# EAGLE design BPS6001 Classic Computing Shield (EAGLE 9.4.2)
DATABASE: E:\Dropbox\GadgetFactory\GadgetFactory_Engineering\Libraries\GadgetFactory-PARTSDB.txt

## Sheet 1 of 7
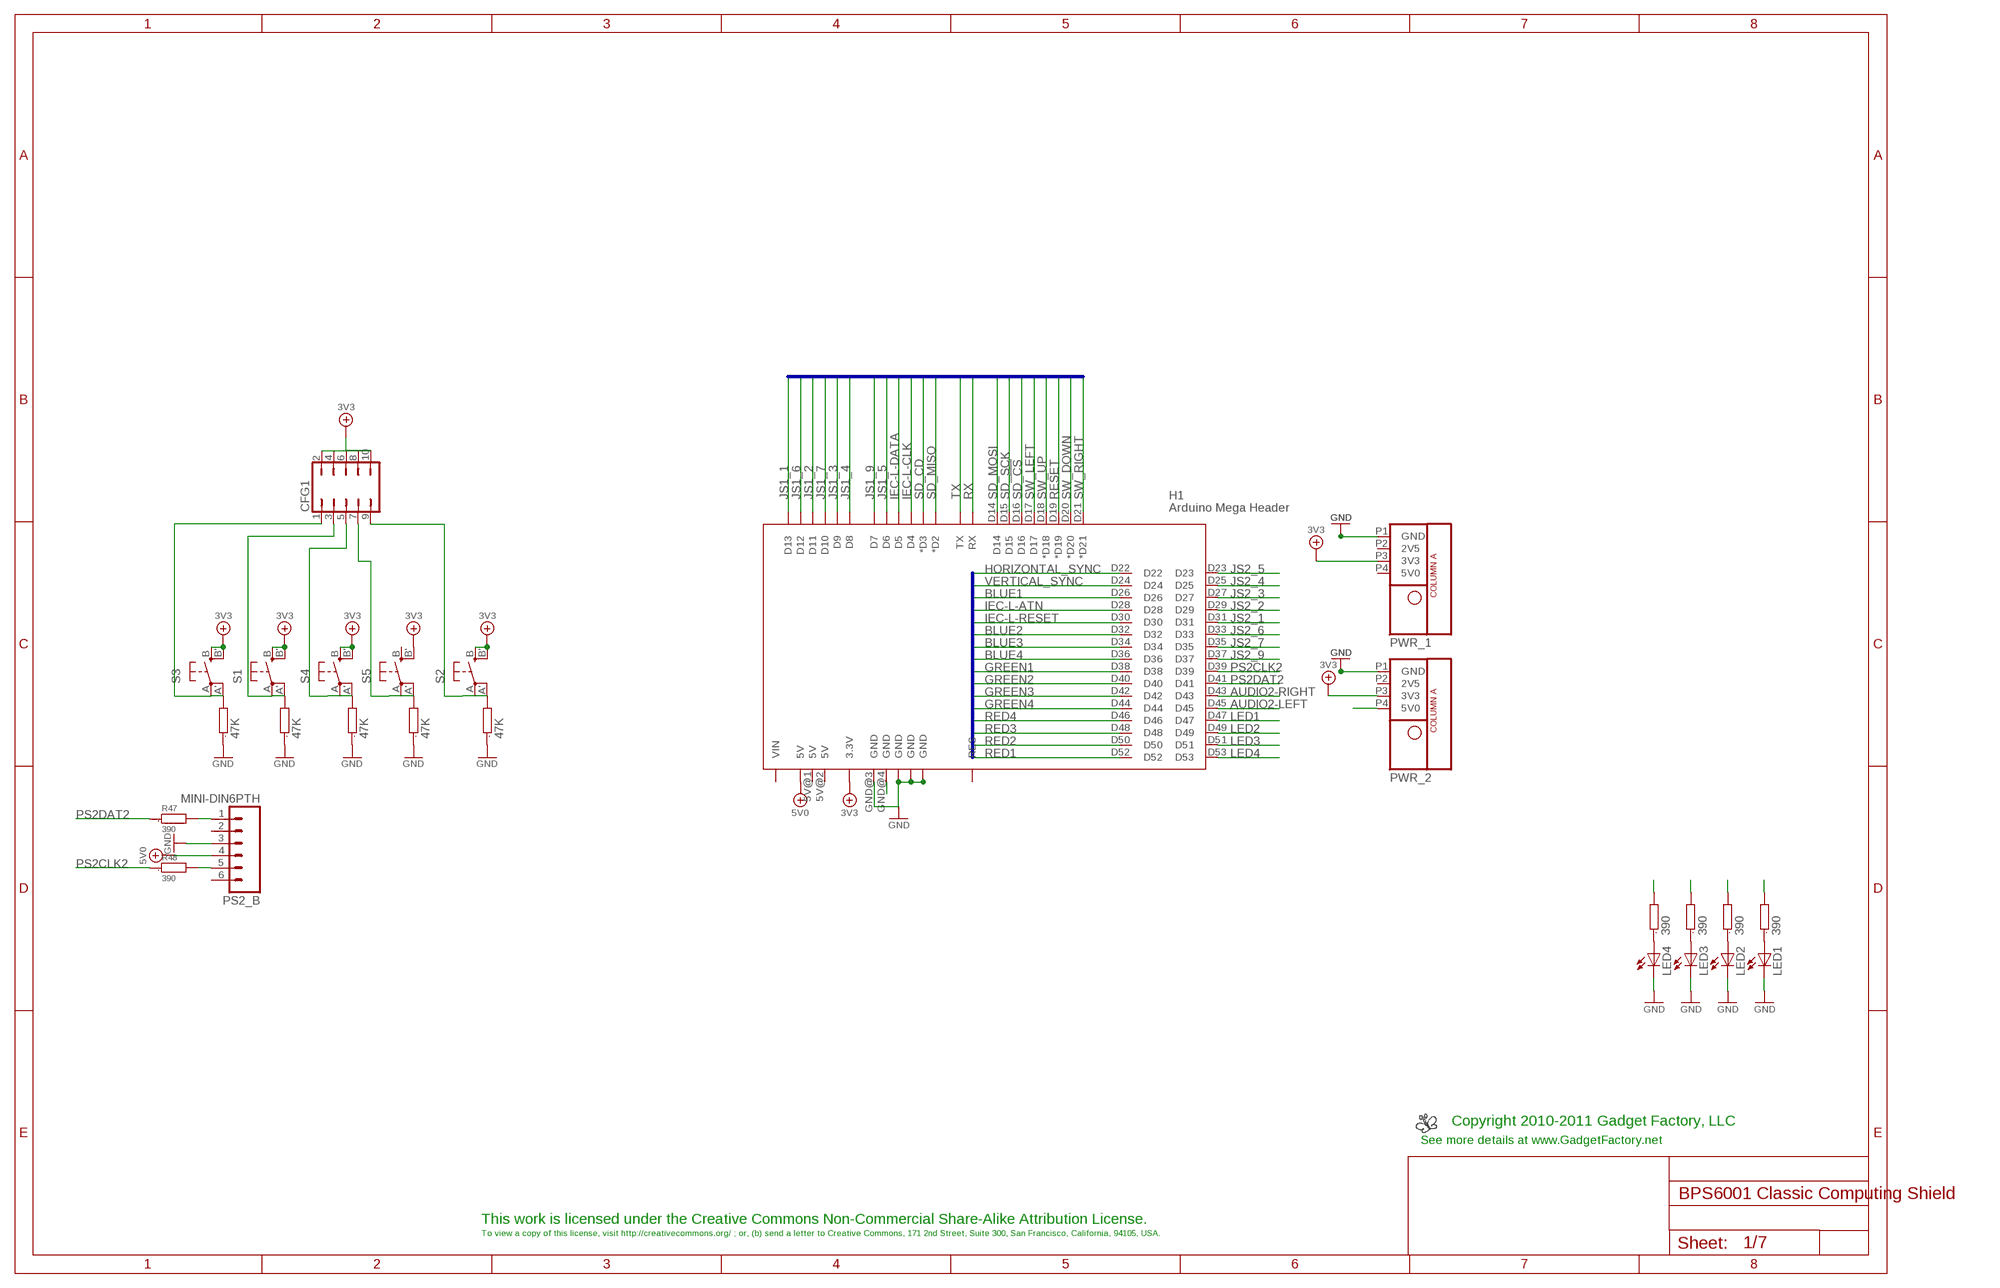
[diagram p0: schematic, sheet 1]

### Parts
CFG1  JP5Q  [JP5Q]
H1  Arduino Mega Header  AMEGA_SHIELD_NOANALOGNO_ANALOG  [AMEGA_SHIELD_NOANALOG]
LED1  LEDCHIPLED_0603  [CHIPLED_0603]
LED2  LEDCHIPLED_0603  [CHIPLED_0603]
LED3  LEDCHIPLED_0603  [CHIPLED_0603]
LED4  LEDCHIPLED_0603  [CHIPLED_0603]
LOGO1  BUTTERFLY_LOGO  [BUTTERFLY_LOGO]
PS2_B  MINI-DIN6PTH  [MINI-DIN6]
PWR_1  POWER_ONLYNOTEXT  [POWER_NO_TEXT]
PWR_2  POWER_ONLYNOTEXT  [POWER_NO_TEXT]
R9  47K  R0603  [0603]
R10  47K  R0603  [0603]
R11  47K  R0603  [0603]
R17  47K  R0603  [0603]
R18  47K  R0603  [0603]
R26  390  R0603  [0603]
R27  390  R0603  [0603]
R43  390  R0603  [0603]
R44  390  R0603  [0603]
R47  390  R0603  [0603]
R48  390  R0603  [0603]
S1  EVQQ2  [EVQ-Q2]
S2  EVQQ2  [EVQ-Q2]
S3  EVQQ2  [EVQ-Q2]
S4  EVQQ2  [EVQ-Q2]
S5  EVQQ2  [EVQ-Q2]

### Nets
3V3_PWR6: CFG1.2 CFG1.4 CFG1.6 CFG1.8 CFG1.10 H1.3.3V S1.B'(S1) S1.B(S) S2.B'(S1) S2.B(S) S3.B'(S1) S3.B(S) S4.B'(S1) S4.B(S) S5.B'(S1) ; supply symbol labelled 3V3 ; also sheet 2,3,5
3V3_PWR7: PWR_2.P3(3V3) ; supply symbol labelled 3V3
5V0: H1.5V@0(5V) ; also sheet 5
5V0_PS2: PS2_B.4 PWR_2.P4(5V0) ; supply symbol labelled 5V0
AUDIO2-LEFT: H1.D45 ; also sheet 4
AUDIO2-RIGHT: H1.D43 ; also sheet 4
BLUE1: H1.D26 ; also sheet 6
BLUE2: H1.D32 ; also sheet 6
BLUE3: H1.D34 ; also sheet 6
BLUE4: H1.D36 ; also sheet 6
GND: H1.GND@0(GND) H1.GND@1(GND) H1.GND@2(GND) H1.GND@3(GND) R9.1 R10.1 R11.1 R17.1 R18.1 ; also sheet 2,3,5,6
GREEN1: H1.D38 ; also sheet 6
GREEN2: H1.D40 ; also sheet 6
GREEN3: H1.D42 ; also sheet 6
GREEN4: H1.D44 ; also sheet 6
HORIZONTAL_SYNC: H1.D22 ; also sheet 6
IEC-L-ATN: H1.D28 ; also sheet 5
IEC-L-CLK: H1.D4 ; also sheet 5
IEC-L-DATA: H1.D5 ; also sheet 5
IEC-L-RESET: H1.D30 ; also sheet 5
JOY_3V3: PWR_1.P3(3V3) ; supply symbol labelled 3V3 ; also sheet 3
JOY_GND: H1.GND@4(GND) LED1.C LED2.C LED3.C LED4.C PS2_B.3 PWR_1.P1(GND) PWR_2.P1(GND) ; supply symbol labelled GND ; also sheet 3,4
JS1_1: H1.D13 ; also sheet 3
JS1_2: H1.D11 ; also sheet 3
JS1_3: H1.D9 ; also sheet 3
JS1_4: H1.D8 ; also sheet 3
JS1_5: H1.D6 ; also sheet 3
JS1_6: H1.D12 ; also sheet 3
JS1_7: H1.D10 ; also sheet 3
JS1_9: H1.D7 ; also sheet 3
JS2_1: H1.D31 ; also sheet 3
JS2_2: H1.D29 ; also sheet 3
JS2_3: H1.D27 ; also sheet 3
JS2_4: H1.D25 ; also sheet 3
JS2_5: H1.D23 ; also sheet 3
JS2_6: H1.D33 ; also sheet 3
JS2_7: H1.D35 ; also sheet 3
JS2_9: H1.D37 ; also sheet 3
LED1: H1.D47 R26.2
LED2: H1.D49 R27.2
LED3: H1.D51 R43.2
LED4: H1.D53 R44.2
N$3: LED4.A R44.1
N$9: LED3.A R43.1
N$10: LED2.A R27.1
N$11: LED1.A R26.1
N$16: PS2_B.1 R47.2
N$17: PS2_B.5 R48.2
PS2CLK2: H1.D39 R48.1
PS2DAT2: H1.D41 R47.1
RED1: H1.D52 ; also sheet 6
RED2: H1.D50 ; also sheet 6
RED3: H1.D48 ; also sheet 6
RED4: H1.D46 ; also sheet 6
RESET: CFG1.9 H1.D19(*D19) R11.2 S2.A'(P1) S2.A(P)
RX: H1.RX
SD_!CS: H1.D16 ; also sheet 2
SD_CD: H1.D3(*D3) ; also sheet 2
SD_MISO: H1.D2(*D2) ; also sheet 2
SD_MOSI: H1.D14 ; also sheet 2
SD_SCK: H1.D15 ; also sheet 2
SW_DOWN: CFG1.5 H1.D20(*D20) R17.2 S4.A'(P1) S4.A(P)
SW_LEFT: CFG1.1 H1.D17 R9.2 S3.A'(P1) S3.A(P)
SW_RIGHT: CFG1.7 H1.D21(*D21) R18.2 S5.A'(P1) S5.A(P)
SW_UP: CFG1.3 H1.D18(*D18) R10.2 S1.A'(P1) S1.A(P)
TX: H1.TX
VERTICAL_SYNC: H1.D24 ; also sheet 6
Unconnected: H1.5V@1(5V) H1.5V@2(5V) H1.RES H1.VIN PS2_B.2 PS2_B.6 PWR_1.P2(2V5) PWR_1.P4(5V0) PWR_2.P2(2V5) S5.B(S)

### Buses
AUDIO-,AUDIO+,BLUE[1..4],GREEN[1..4],HORIZONTAL_SYNC,IEC-L-CLK,IEC-L-DATA,JS1_[1..9],JS2_[1..9],LED[1..4],PS2CLK2,PS2DAT2,RED[1..4],RESET,SW[1..4]

### Notes on the sheet
- Copyright 2010-2011 Gadget Factory, LLC
- See more details at www.GadgetFactory.net
- This work is licensed under the Creative Commons Non-Commercial Share-Alike Attribution License.
- To view a copy of this license, visit http://creativecommons.org/ ; or, (b) send a letter to Creative Commons, 171 2nd Street, Suite 300, San Francisco, California, 94105, USA.

## Sheet 2 of 7: SD Card
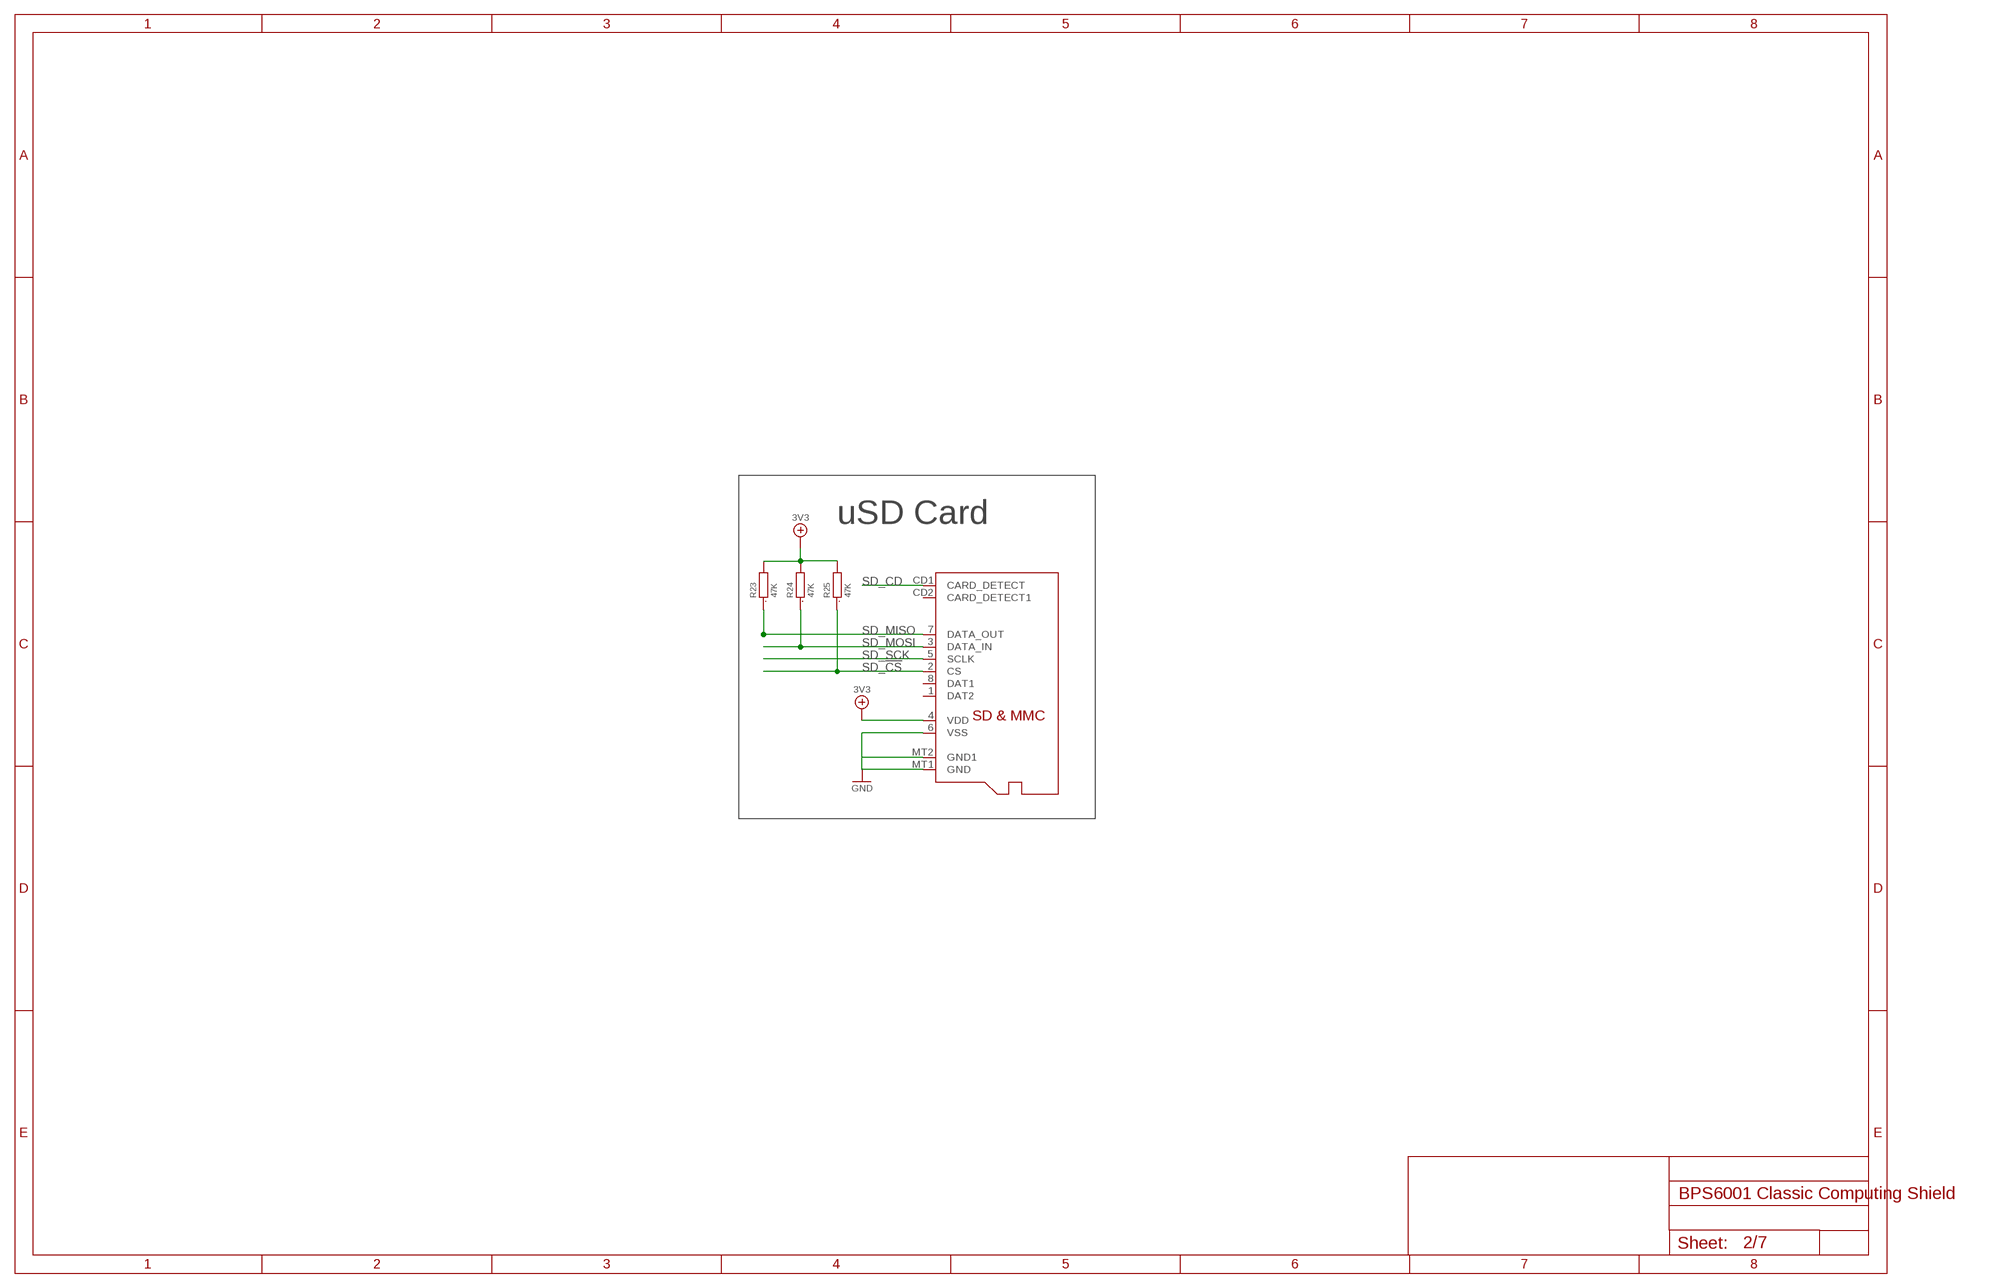
[diagram p1: schematic, sheet 2]

### Parts
R23  47K  R0603  [0603]
R24  47K  R0603  [0603]
R25  47K  R0603  [0603]
SD1  MICROSD  [MICROSD]

### Nets
3V3_PWR6: R23.2 R24.2 R25.2 SD1.4(VDD) ; supply symbol labelled 3V3 ; also sheet 1,3,5
GND: SD1.6(VSS) SD1.MT1(GND) SD1.MT2(GND1) ; also sheet 1,3,5,6
SD_!CS: R25.1 SD1.2(CS) ; also sheet 1
SD_CD: SD1.CD1(CARD_DETECT) ; also sheet 1
SD_MISO: R23.1 SD1.7(DATA_OUT) ; also sheet 1
SD_MOSI: R24.1 SD1.3(DATA_IN) ; also sheet 1
SD_SCK: SD1.5(SCLK) ; also sheet 1
Unconnected: SD1.1(DAT2) SD1.8(DAT1) SD1.CD2(CARD_DETECT1)

### Notes on the sheet
- uSD Card

## Sheet 3 of 7: Joysticks
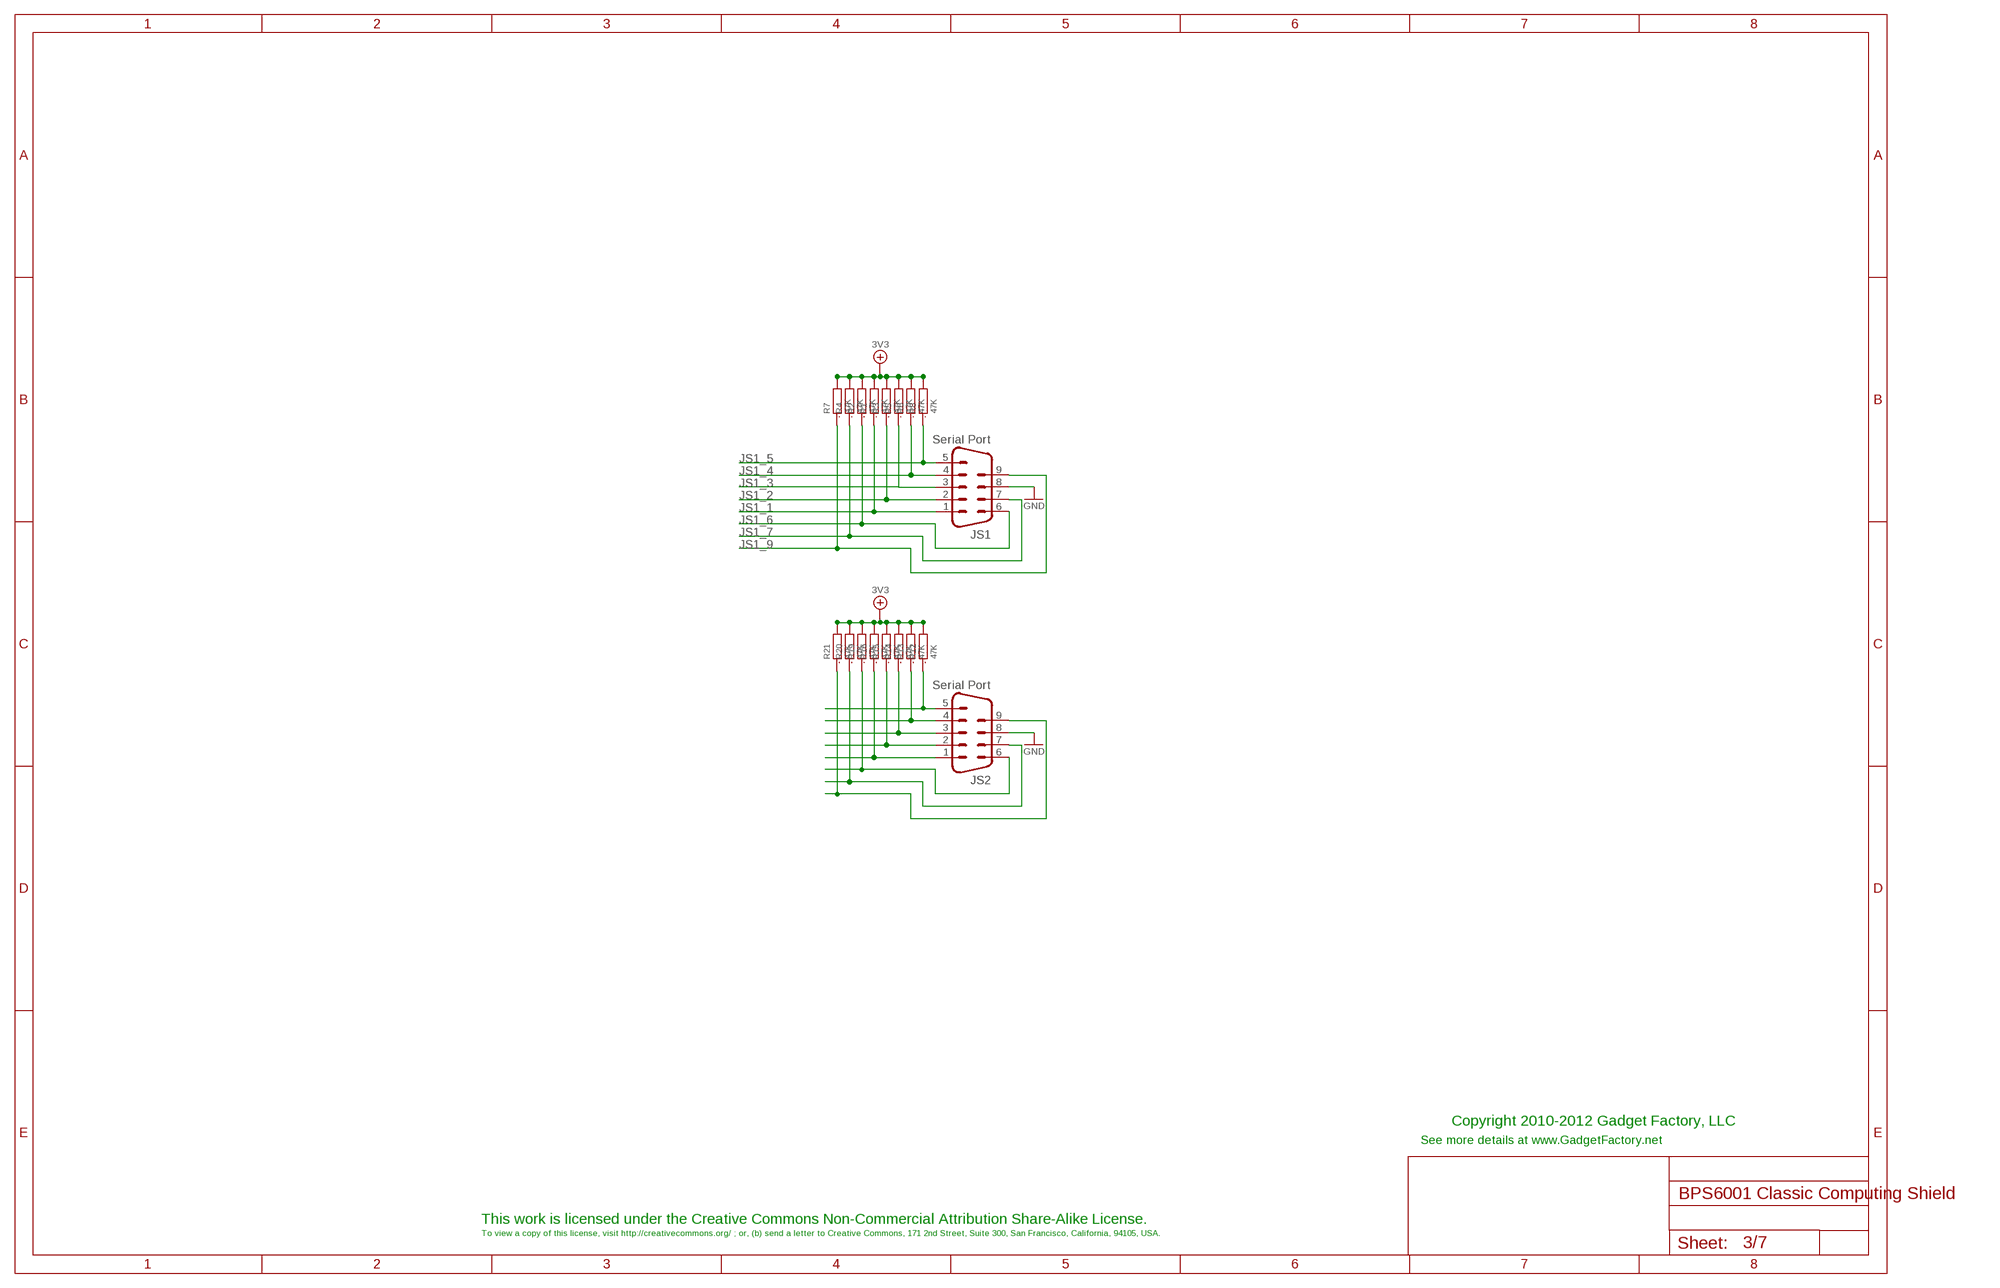
[diagram p2: schematic, sheet 3]

### Parts
JS1  Serial Port  M09HP  [M09HP]
JS2  Serial Port  M09HP  [M09HP]
R1  47K  R0603  [0603]
R2  47K  R0603  [0603]
R3  47K  R0603  [0603]
R4  47K  R0603  [0603]
R5  47K  R0603  [0603]
R6  47K  R0603  [0603]
R7  47K  R0603  [0603]
R8  47K  R0603  [0603]
R12  47K  R0603  [0603]
R13  47K  R0603  [0603]
R14  47K  R0603  [0603]
R15  47K  R0603  [0603]
R16  47K  R0603  [0603]
R19  47K  R0603  [0603]
R20  47K  R0603  [0603]
R21  47K  R0603  [0603]

### Nets
3V3_PWR6: R1.2 R2.2 R3.2 R4.2 R5.2 R6.2 R7.2 R8.2 ; also sheet 1,2,5
GND: JS1.8 ; also sheet 1,2,5,6
JOY_3V3: R12.2 R13.2 R14.2 R15.2 R16.2 R19.2 R20.2 R21.2 ; also sheet 1
JOY_GND: JS2.8 ; supply symbol labelled GND ; also sheet 1,4
JS1_1: JS1.1 R1.1 ; also sheet 1
JS1_2: JS1.2 R3.1 ; also sheet 1
JS1_3: JS1.3 R5.1 ; also sheet 1
JS1_4: JS1.4 R6.1 ; also sheet 1
JS1_5: JS1.5 R8.1 ; also sheet 1
JS1_6: JS1.6 R2.1 ; also sheet 1
JS1_7: JS1.7 R4.1 ; also sheet 1
JS1_9: JS1.9 R7.1 ; also sheet 1
JS2_1: JS2.1 R16.1 ; also sheet 1
JS2_2: JS2.2 R15.1 ; also sheet 1
JS2_3: JS2.3 R14.1 ; also sheet 1
JS2_4: JS2.4 R13.1 ; also sheet 1
JS2_5: JS2.5 R12.1 ; also sheet 1
JS2_6: JS2.6 R19.1 ; also sheet 1
JS2_7: JS2.7 R20.1 ; also sheet 1
JS2_9: JS2.9 R21.1 ; also sheet 1

### Notes on the sheet
- Copyright 2010-2012 Gadget Factory, LLC
- See more details at www.GadgetFactory.net
- This work is licensed under the Creative Commons Non-Commercial Attribution Share-Alike License.
- To view a copy of this license, visit http://creativecommons.org/ ; or, (b) send a letter to Creative Commons, 171 2nd Street, Suite 300, San Francisco, California, 94105, USA.

## Sheet 4 of 7: Audio
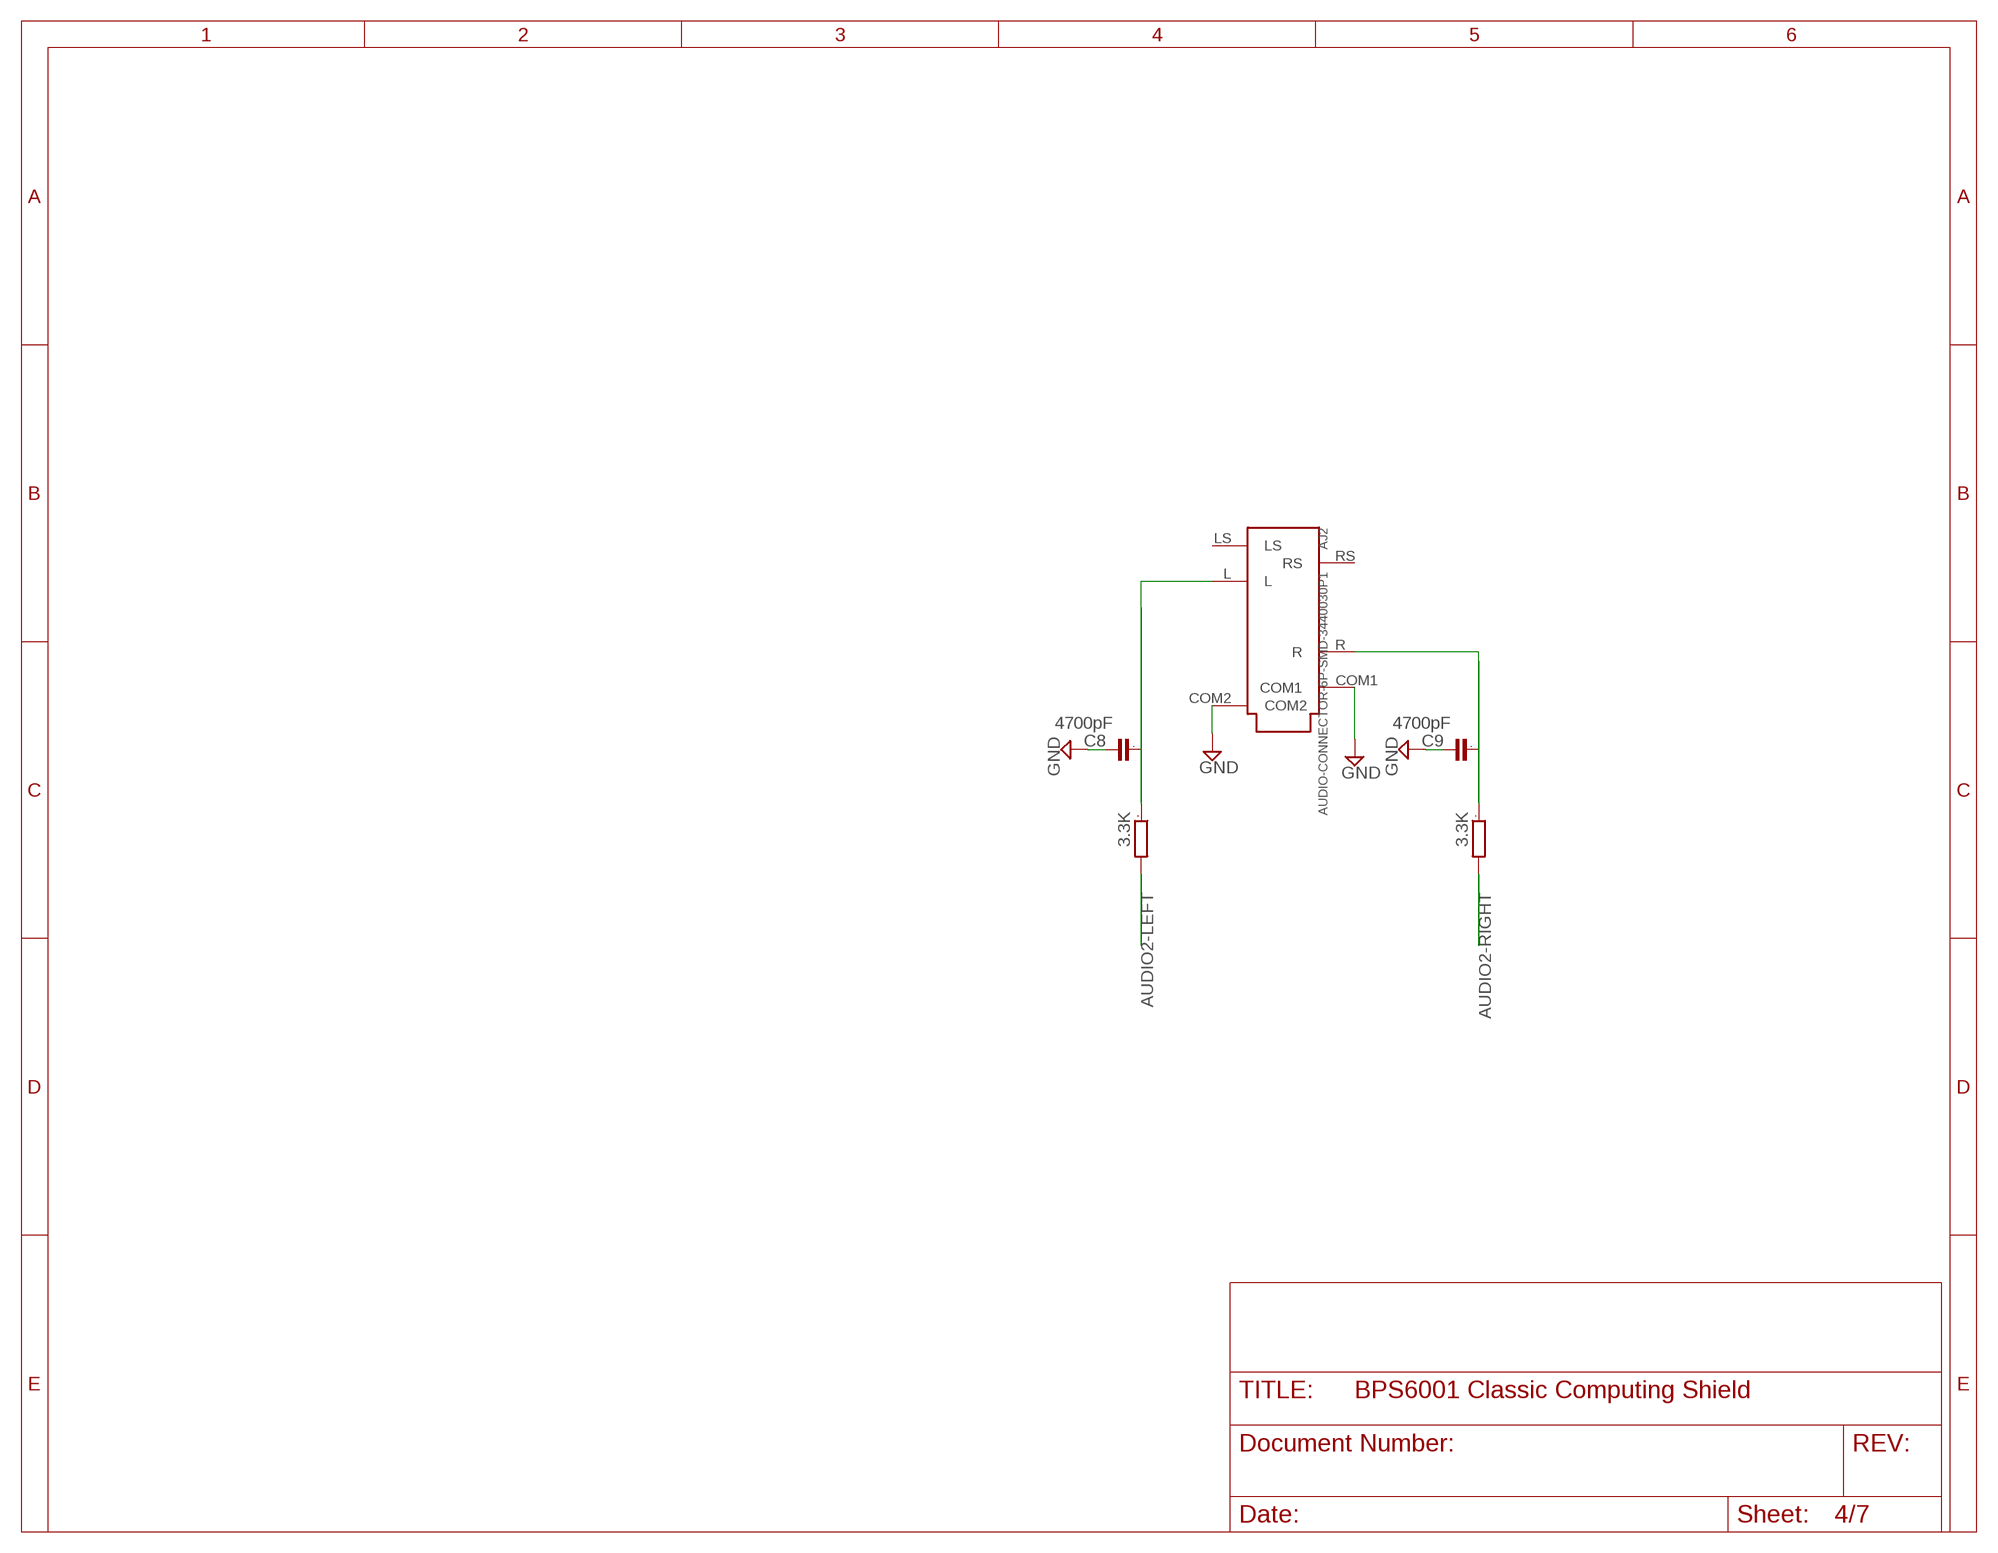
[diagram p3: schematic, sheet 4]

### Parts
AJ2  AUDIO-CONNECTOR-6P-SMD-3440030P1  [6P-SMD-3.5]
C8  4700pF  C0603  [0603]
C9  4700pF  C0603  [0603]
R45  3.3K  R0603  [0603]
R46  3.3K  R0603  [0603]

### Nets
AUDIO2-LEFT: R45.2 ; also sheet 1
AUDIO2-RIGHT: R46.2 ; also sheet 1
JOY_GND: AJ2.COM1 AJ2.COM2 C8.2 C9.2 ; supply symbol labelled GND ; also sheet 1,3
N$1: AJ2.L C8.1 R45.1
N$15: AJ2.R C9.1 R46.1
Unconnected: AJ2.LS AJ2.RS

## Sheet 5 of 7: RS232 IEC
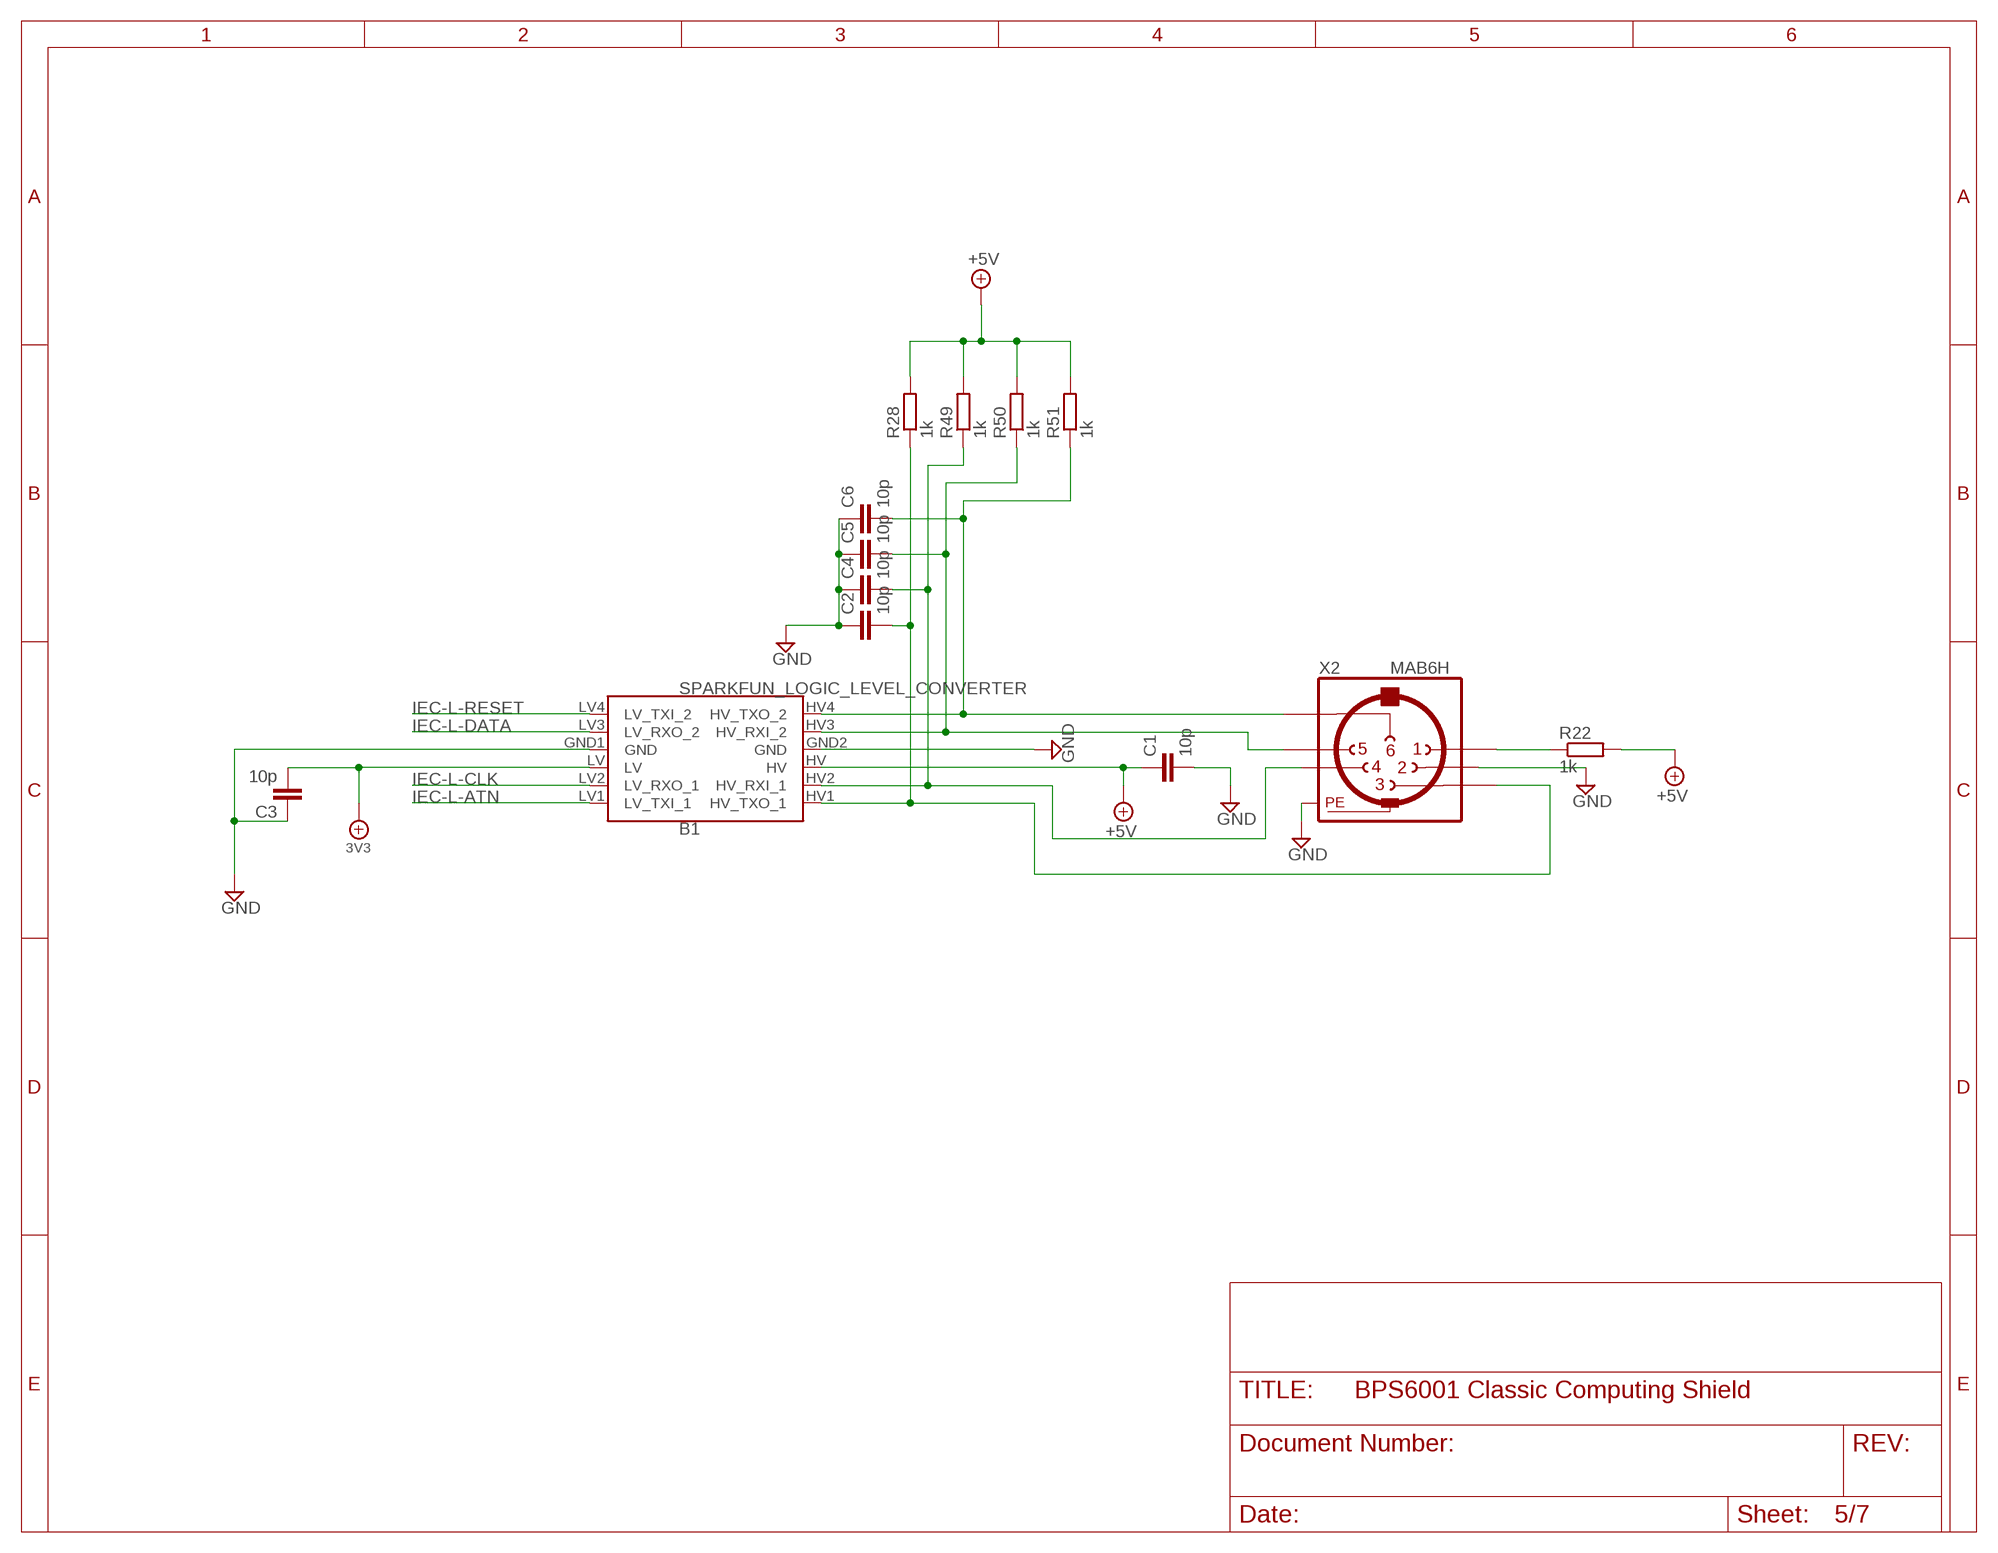
[diagram p4: schematic, sheet 5]

### Parts
B1  SPARKFUN_LOGIC_LEVEL_CONVERTER  [SPARKFUN_LOGIC_LEVEL_CONVERTER]
C1  10p  C-EUC0603  [C0603]
C2  10p  C-EUC0603  [C0603]
C3  10p  C-EUC0603  [C0603]
C4  10p  C-EUC0603  [C0603]
C5  10p  C-EUC0603  [C0603]
C6  10p  C-EUC0603  [C0603]
R22  1k  R-EU_R0603  [R0603]
R28  1k  R-EU_R0603  [R0603]
R49  1k  R-EU_R0603  [R0603]
R50  1k  R-EU_R0603  [R0603]
R51  1k  R-EU_R0603  [R0603]
X2  MAB6H  [MAB6H]

### Nets
3V3_PWR6: B1.LV C3.2 ; supply symbol labelled 3V3 ; also sheet 1,2,3
5V0: B1.HV C1.1 R22.2 R28.2 R49.2 R50.2 R51.2 ; supply symbol labelled +5V ; also sheet 1
GND: B1.GND1(GND) B1.GND2(GND) C1.2 C2.1 C3.1 C4.1 C5.1 C6.1 X2.2 X2.PE X2.PE@(PE) ; also sheet 1,2,3,6
IEC-H-ATN: B1.HV1(HV_TXO_1) C2.2 R28.1 X2.3
IEC-H-CLK: B1.HV2(HV_RXI_1) C4.2 R49.1 X2.4
IEC-H-DATA: B1.HV3(HV_RXI_2) C5.2 R50.1 X2.5
IEC-H-RESET: B1.HV4(HV_TXO_2) C6.2 R51.1 X2.6
IEC-H-SRQ: R22.1 X2.1
IEC-L-ATN: B1.LV1(LV_TXI_1) ; also sheet 1
IEC-L-CLK: B1.LV2(LV_RXO_1) ; also sheet 1
IEC-L-DATA: B1.LV3(LV_RXO_2) ; also sheet 1
IEC-L-RESET: B1.LV4(LV_TXI_2) ; also sheet 1

## Sheet 6 of 7: 4096 VGA
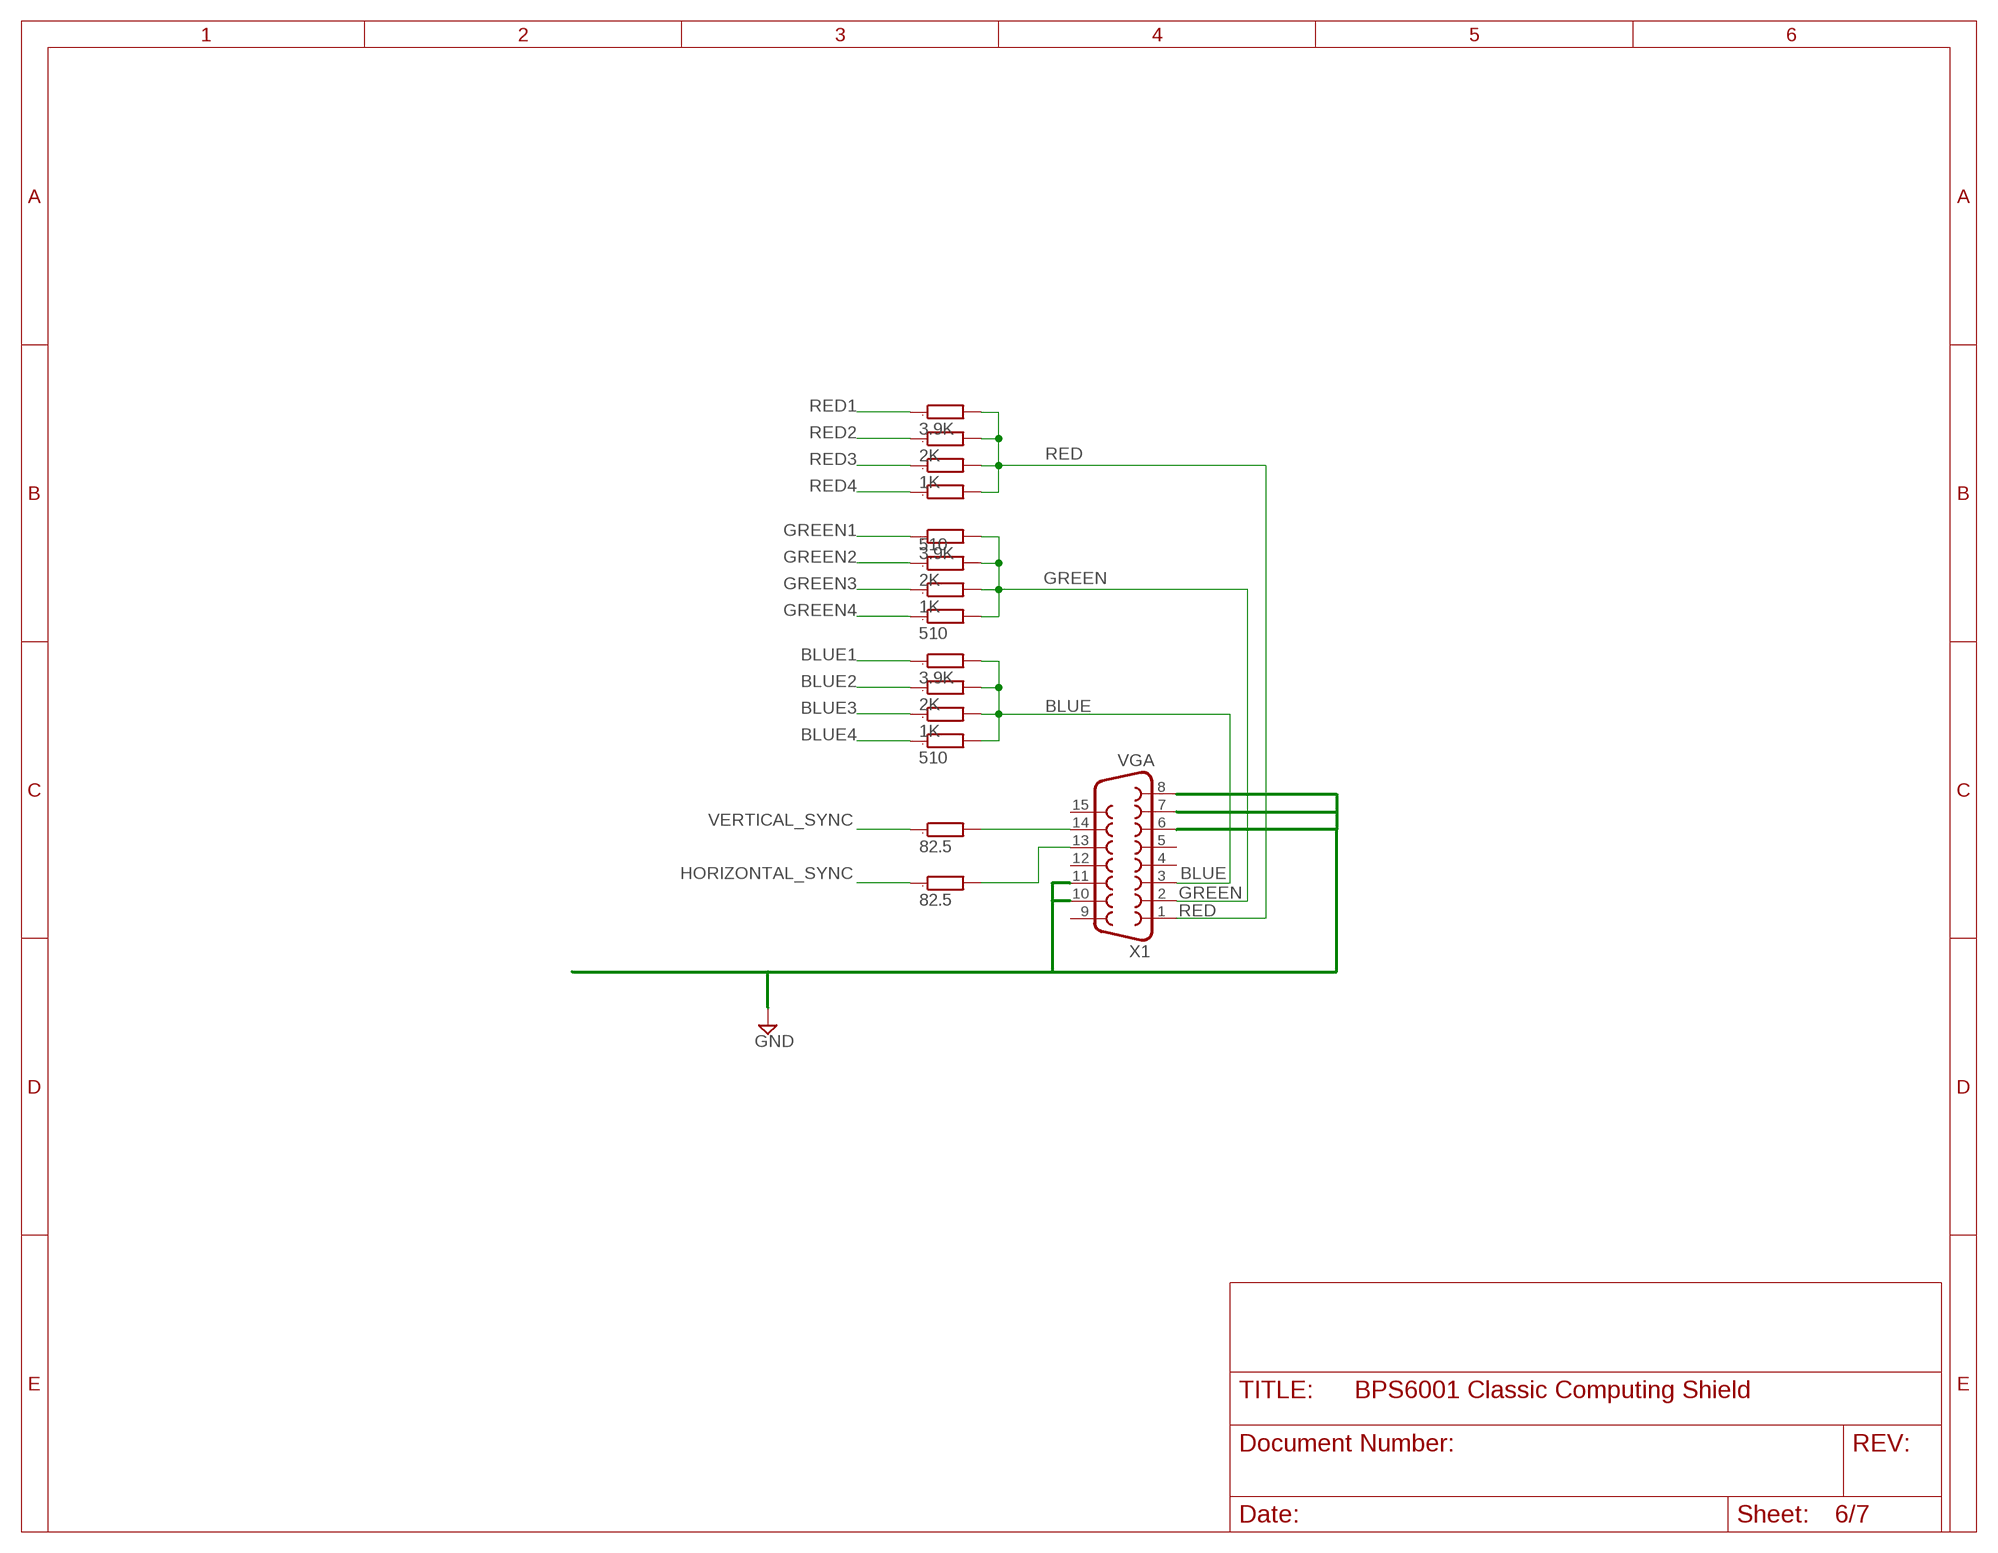
[diagram p5: schematic, sheet 6]

### Parts
R29  82.5  R0603  [0603]
R30  82.5  R0603  [0603]
R31  3.9K  R0603  [0603]
R32  2K  R0603  [0603]
R33  1K  R0603  [0603]
R34  510  R0603  [0603]
R35  3.9K  R0603  [0603]
R36  2K  R0603  [0603]
R37  1K  R0603  [0603]
R38  510  R0603  [0603]
R39  510  R0603  [0603]
R40  1K  R0603  [0603]
R41  2K  R0603  [0603]
R42  3.9K  R0603  [0603]
X1  VGA  F15HDH  [HDF15H]

### Nets
BLUE: R31.2 R32.2 R33.2 R34.2 X1.3
BLUE1: R31.1 ; also sheet 1
BLUE2: R32.1 ; also sheet 1
BLUE3: R33.1 ; also sheet 1
BLUE4: R34.1 ; also sheet 1
GND: X1.6 X1.7 X1.8 X1.10 X1.11 ; also sheet 1,2,3,5
GREEN: R35.2 R36.2 R37.2 R38.2 X1.2
GREEN1: R35.1 ; also sheet 1
GREEN2: R36.1 ; also sheet 1
GREEN3: R37.1 ; also sheet 1
GREEN4: R38.1 ; also sheet 1
HORIZONTAL_SYNC: R29.1 ; also sheet 1
N$4: R29.2 X1.13
N$5: R30.2 X1.14
RED: R39.2 R40.2 R41.2 R42.2 X1.1
RED1: R42.1 ; also sheet 1
RED2: R41.1 ; also sheet 1
RED3: R40.1 ; also sheet 1
RED4: R39.1 ; also sheet 1
VERTICAL_SYNC: R30.1 ; also sheet 1
Unconnected: X1.4 X1.5 X1.9 X1.12 X1.15

## Sheet 7 of 7

## Library data of the parts
AJ2 = OPL Eagle Library:AUDIO-CONNECTOR-6P-SMD: When you use the footprint ,place notice 46 (layer)milling ,there is some important information.; PARTNO: 3440030P1
B1 = SparkFun-Boards:SPARKFUN_LOGIC_LEVEL_CONVERTER: SparkFun Logic Level Converter -Bi-Directional This is the mechnical outline for the 3.3V - 5V bi directional logic level converter. *Note, the "LOCK" Package has the header pins staggered by an offset of 5 mils (off center line), so that when you slide a row of standard 0.1" headers into the PTH pads, it will hold position vertically. See the follwing turorial for more information on this type of special footprints: Sneaky Footprints <https://www.sparkfun.com/tutorials/114> SparkFun Products: SparkFun Logic Level Converter - Bi-Directional <https://www.sparkfun.com/products/12009>
C1-C6 = resistor:C-EU: CAPACITOR, European symbol
C8 C9 = GadgetFactory:C: CAPACITOR, European symbol; PARTNO: C0603C472J5RACTU
CFG1 = jumper:JP5Q: JUMPER; PARTNO: M20-9720545
H1 = Papilio:AMEGA_SHIELD_NOANALOG; PARTNO: Arduino_Mega_Header
JS1 JS2 = con-subd:M09: SUB-D; PARTNO: 10090097-P094VLF
LED1-LED4 = led:LED: LED OSRAM: - CHIPLED LG R971, LG N971, LY N971, LG Q971, LY Q971, LO R971, LY R971 LH N974, LH R974 LS Q976, LO Q976, LY Q976 LO Q996 - Hyper CHIPLED LW Q18S LB Q993, LB Q99A, LB R99A - SideLED LS A670, LO A670, LY A670, LG A670, LP A670 LB A673, LV A673, LT A673, LW A673 LH A674 LY A675 LS A676, LA A676, LO A676, LY A676, LW A676 LS A679, LY A679, LG A679 - Hyper Micro SIDELED® LS Y876, LA Y876, LO Y876, LY Y876 LT Y87S - SmartLED LW L88C, LW L88S LB L89C, LB L89S, LG L890 LS L89K, LO L89K, LY L89K LS L896, LA L896, LO L896, LY L896 - TOPLED LS T670, LO T670, LY T670, LG T670, LP T670 LSG T670, LSP T670, LSY T670, LOP T670, LYG T670 LG T671, LOG T671, LSG T671 LB T673, LV T673, LT T673, LW T673 LH T674 LS T676, LA T676, LO T676, LY T676, LB T676, LH T676, LSB T676, LW T676 LB T67C, LV T67C, LT T67C, LS T67K, LO T67K, LY T67K, LW E67C LS E67B, LA E67B, LO E67B, LY E67B, LB E67C, LV E67C, LT E67C LW T67C LS T679, LY T679, LG T679 LS T770, LO T770, LY T770, LG T770, LP T770 LB T773, LV T773, LT T773, LW T773 LH T774 LS E675, LA E675, LY E675, LS T675 LS T776, LA T776, LO T776, LY T776, LB T776 LHGB T686 LT T68C, LB T68C - Hyper Mini TOPLED® LB M676 - Mini TOPLED Santana® LG M470 LS M47K, LO M47K, LY M47K Source: http://www.osram.convergy.de LUXEON: - LUMILED® LXK2-PW12-R00, LXK2-PW12-S00, LXK2-PW14-U00, LXK2-PW14-V00 LXK2-PM12-R00, LXK2-PM12-S00, LXK2-PM14-U00 LXK2-PE12-Q00, LXK2-PE12-R00, LXK2-PE12-S00, LXK2-PE14-T00, LXK2-PE14-U00 LXK2-PB12-K00, LXK2-PB12-L00, LXK2-PB12-M00, LXK2-PB14-N00, LXK2-PB14-P00, LXK2-PB14-Q00 LXK2-PR12-L00, LXK2-PR12-M00, LXK2-PR14-Q00, LXK2-PR14-R00 LXK2-PD12-Q00, LXK2-PD12-R00, LXK2-PD12-S00 LXK2-PH12-R00, LXK2-PH12-S00 LXK2-PL12-P00, LXK2-PL12-Q00, LXK2-PL12-R00 Source: www.luxeon.com KINGBRIGHT: KA-3528ASYC Source: www.kingbright.com; PARTNO: LTST-C190GKT
LOGO1 = GadgetFactory_Pub:BUTTERFLY_LOGO; BOM: EXCLUDE
PS2_B = SparkFun-Connectors:MINI-DIN6: mini DIN 6 Connector Commonly found on the back of a computer for PS2 keyboard and mice. Schematic and footprint are proven. Spark Fun Electronics SKU : PRT-08509
PWR_1 PWR_2 = Papilio:POWER_ONLY; BOM: EXCLUDE
R1-R21 = GadgetFactory:R: RESISTOR, European symbol; PARTNO: RMCF0603JT47K0
R22 R28 R49-R51 = resistor:R-EU_: RESISTOR, European symbol
R23-R25 = GadgetFactory_6.0:R: RESISTOR, European symbol; PARTNO: RMCF0603JT47K0
R26 R27 R43 R44 = GadgetFactory:R: RESISTOR, European symbol; PARTNO: RMCF0603JT390R
R29 R30 = GadgetFactory:R: RESISTOR, European symbol; PARTNO: RMCF0603FT82R5
R31 R35 R42 = GadgetFactory:R: RESISTOR, European symbol; PARTNO: RMCF0603JT3K90
R32 R36 R41 = GadgetFactory:R: RESISTOR, European symbol; PARTNO: RMCF0603JT2K00
R33 R37 R40 = GadgetFactory:R: RESISTOR, European symbol; PARTNO: RMCF0603JT1K00
R34 R38 R39 = GadgetFactory:R: RESISTOR, European symbol; PARTNO: RMCF0603JT510R
R45 R46 = GadgetFactory:R: RESISTOR, European symbol; PARTNO: RMCF0603JT3K30
R47 R48 = GadgetFactory_6.0:R: RESISTOR, European symbol; PARTNO: RMCF0603JT390R
S1-S5 = adafruit:EVQQ2: SMT 6mm switch, EVQQ2 series http://www.ladyada.net/library/eagle; PARTNO: PTS525SM10SMTR LFS
SD1 = adafruit:MICROSD: Micro-SD / Transflash card holder with SPI pinout For the 3M # 2908-05WB-MG and/or 4UCON #19656 push-push type; PARTNO: 101-00660-68-6
X1 = GadgetFactory_6.0:F15: SUB-D; OC_FARNELL: unknown; OC_NEWARK: unknown; PARTNO: 1-1734530-1
X2 = con-hirschmann:MAB6H: Female CONNECTOR 6 pins with shield, horizontal (DIN 45322); MF: FARNELL; MPN: MAB 6 H; OC_FARNELL: 809901; OC_NEWARK: 67C7887

## Board
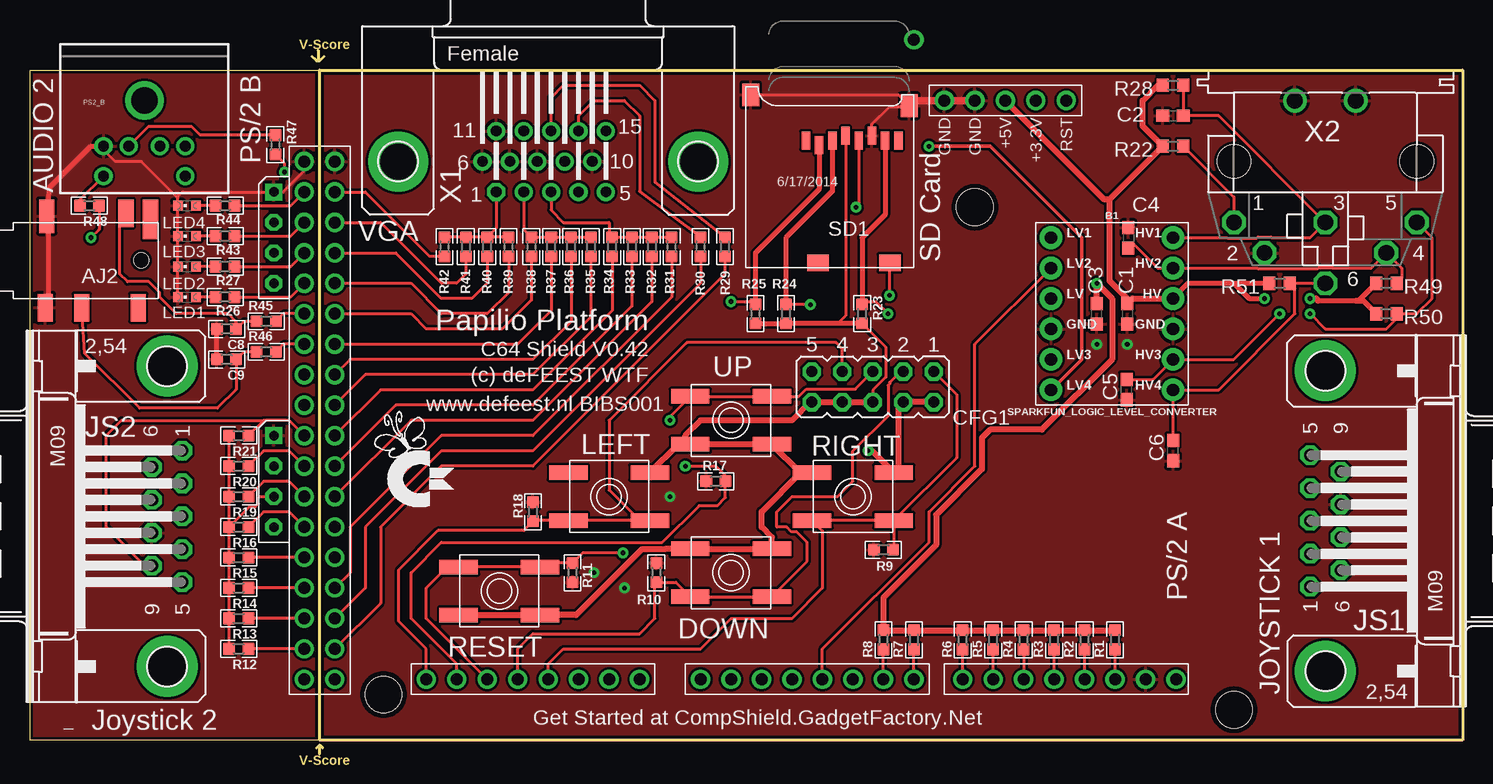
[diagram p6: board, top side]
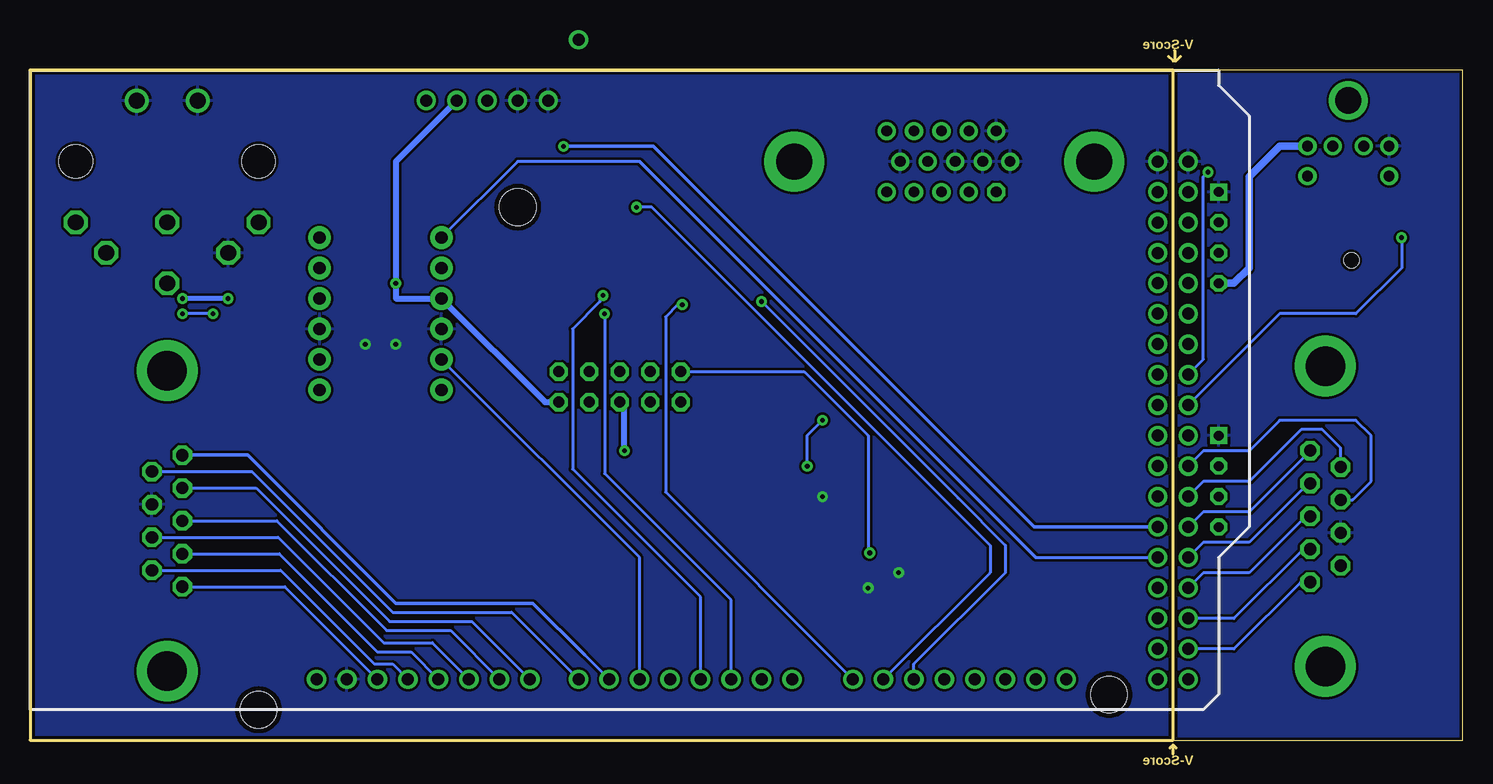
[diagram p7: board, bottom side, seen from below]

Size 119.38 x 58.67 mm. Coordinates in mm from the lower left corner, seen from the top.
Outline: 24.13,1.14 119.38,1.14 119.38,57.02 24.13,57.02
Outline: 24.13,1.14 24.13,57.02
Outline: 24.13,1.14 0,1.14 0,57.02 24.13,57.02
Outline: 24,58.67 24,57.79
Outline: 24,57.79 24.13,57.79 24.51,58.17
Outline: 24,57.79 23.88,57.79 23.5,58.17
Outline: 24.13,0 24.13,0.76
Outline: 24.13,0.76 23.88,0.51
Outline: 24.13,0.76 24.38,0.51
Copper layers (1*16): Top 0.035mm / dielectric 1.5mm / Bottom 0.035mm
Design rules "SparkFun_Derived_GoldePheonix_10mil": minimum track width 10mil, minimum drill 15mil, track to track 8mil, track to pad 8mil, pad to pad 8mil, via to via 8mil, smd to smd 8mil, copper to edge 10mil, drill to drill 8mil, minimum pad ring 12mil, minimum via ring 10mil, stop-mask expansion 4mil, vias tented up to drill 18mil, thermal gap 10mil

### Footprints (pad centres in the part's own frame; a part is rotated, then mirrored left to right if it is on the bottom)
6P-SMD-3.5 = smd 1.27 x 2.286: COM1 2.413,3.937; L -4.318,-3.937; R -0.635,3.937; RS -5.334,3.937 | smd 1.27 x 2.794: COM2 2.286,-3.683 | smd 1.27 x 3.302: LS -6.35,-3.429 | hole 1.27: -5.588,0
SPARKFUN_LOGIC_LEVEL_CONVERTER = drill 1.016 pad 1.88: GND1 -5.08,-1.27; GND2 5.08,-1.27; HV 5.08,1.27; HV1 5.08,6.35; HV2 5.08,3.81; HV3 5.08,-3.81; HV4 5.08,-6.35; LV -5.08,1.27; LV1 -5.08,6.35; LV2 -5.08,3.81; LV3 -5.08,-3.81; LV4 -5.08,-6.35
C0603 = smd 1.1 x 1: 1 -0.85,0; 2 0.85,0
0603 = smd 1 x 1: 1 -0.8,0; 2 0.8,0
JP5Q = drill 0.914 octagon: 1 -5.08,-1.27; 2 -5.08,1.27; 3 -2.54,-1.27; 4 -2.54,1.27; 5 0,-1.27; 6 0,1.27; 7 2.54,-1.27; 8 2.54,1.27; 9 5.08,-1.27; 10 5.08,1.27
AMEGA_SHIELD_NOANALOG = drill 1 pad 1.422: 3.3V 35.56,2.54; 5V@0 38.1,2.54; 5V@1 93.98,50.8; 5V@2 96.52,50.8; AREF 23.876,50.8; D2 58.42,50.8; D3 55.88,50.8; D4 53.34,50.8; D5 50.8,50.8; D6 48.26,50.8; D7 45.72,50.8; D8 41.656,50.8; D9 39.116,50.8; D10 36.576,50.8; D11 34.036,50.8; D12 31.496,50.8; D13 28.956,50.8; D14 68.58,50.8; D15 71.12,50.8; D16 73.66,50.8; D17 76.2,50.8; D18 78.74,50.8; D19 81.28,50.8; D20 83.82,50.8; D21 86.36,50.8; D22 93.98,48.26; D23 96.52,48.26; D24 93.98,45.72; D25 96.52,45.72; D26 93.98,43.18; D27 96.52,43.18; D28 93.98,40.64; D29 96.52,40.64; D30 93.98,38.1; D31 96.52,38.1; D32 93.98,35.56; D33 96.52,35.56; D34 93.98,33.02; D35 96.52,33.02; D36 93.98,30.48; D37 96.52,30.48; D38 93.98,27.94; D39 96.52,27.94; D40 93.98,25.4; D41 96.52,25.4; D42 93.98,22.86; D43 96.52,22.86; D44 93.98,20.32; D45 96.52,20.32; D46 93.98,17.78; D47 96.52,17.78; D48 93.98,15.24; D49 96.52,15.24; D50 93.98,12.7; D51 96.52,12.7; D52 93.98,10.16; D53 96.52,10.16; GND@0 40.64,2.54; GND@1 43.18,2.54; GND@2 26.416,50.8; GND@3 93.98,7.62; GND@4 96.52,7.62; RES 33.02,2.54; RX 63.5,50.8; TX 60.96,50.8; VIN 45.72,-2.54
M09HP = drill 1.016 octagon: 1 -5.486,1.27; 2 -2.743,1.27; 3 0,1.27; 4 2.743,1.27; 5 5.486,1.27; 6 -4.115,-1.27; 7 -1.372,-1.27; 8 1.372,-1.27; 9 4.115,-1.27 | drill 3.302 pad 5.08: G1 -12.522,0; G2 12.522,0
CHIPLED_0603 = smd 0.8 x 0.8: A 0,-0.75; C 0,0.75
MINI-DIN6 = drill 0.9: 1 -1.3,-8.5; 2 1.3,-8.5; 3 -3.4,-8.5; 4 3.4,-8.5; 5 -3.4,-11; 6 3.4,-11 | drill 2.2: P$1 0,-4.7
POWER_NO_TEXT = drill 0.8 square: P1 0,3.81 | drill 0.8 octagon: P2 0,1.27; P3 0,-1.27; P4 0,-3.81
R0603 = smd 1 x 1.1: 1 -0.85,0; 2 0.85,0
EVQ-Q2 = smd 3.2 x 1.2: A -3.4,-2; A' 3.4,-2; B -3.4,2; B' 3.4,2
MICROSD = smd 0.7 x 1.5: 1 9,-10.64; 2 7.9,-10.24; 3 6.8,-10.64; 4 5.7,-11.04; 5 4.6,-10.64; 6 3.5,-11.04; 7 2.4,-10.64; 8 1.3,-10.64 | smd 1.8 x 1.4: CD1 2,-0.44; CD2 8,-0.44 | smd 1.4 x 1.9: MT1 0.4,-13.54; MT2 13.6,-14.44
STAND-OFF-TIGHT = hole 3.048: 0,0
HDF15H = drill 0.9 octagon: 1 4.329,2.54 | drill 0.9: 2 2.043,2.54; 3 -0.243,2.54; 4 -2.529,2.54; 5 -4.815,2.54; 6 5.472,0; 7 3.186,0; 8 0.9,0; 9 -1.386,0; 10 -3.672,0; 11 4.329,-2.54; 12 2.043,-2.54; 13 -0.243,-2.54; 14 -2.529,-2.54; 15 -4.815,-2.54 | drill 3 pad 5: P$1 -12.5,0; P$2 12.5,0
MAB6H = drill 1.321 octagon: 1 7.62,5.08; 2 5.08,7.62; 3 0,5.08; 4 -5.08,7.62; 5 -7.62,5.08; 6 0,10.16 | drill 1.321: PE -2.54,-5.08; PE@ 2.54,-5.08 | hole 2.794: 7.62,0; -7.62,0

### Placement (x,y rotation side)
AJ2  3.68,41.15 180 top
B1  90.17,36.7 0 top
C1  91.44,36.7 270 top
C2  95.25,53.21 0 top
C3  88.9,36.7 90 top
C4  91.54,43.03 270 top
C5  91.39,30.38 90 top
C6  95.25,25.3 90 top
C8  16.38,35.43 180 top
C9  16.38,32.89 180 top
CFG1  70.23,30.61 180 top
H1  119.38,57.02 180 top
JS1  107.95,19.43 90 top
JS2  11.43,19.81 270 top
LED1  13.08,38.1 90 top
LED2  13.08,40.64 90 top
LED3  13.08,43.18 90 top
LED4  13.08,45.72 90 top
LOGO1  30.96,26.11 0 top
PS2_B  9.53,59.18 0 top
PWR_1  20.32,22.73 0 top
PWR_2  20.32,43.05 0 top
R1  90.42,9.53 90 top
R2  87.88,9.53 90 top
R3  85.34,9.53 90 top
R4  82.8,9.53 90 top
R5  80.26,9.53 90 top
R6  77.72,9.53 90 top
R7  73.66,9.53 90 top
R8  71.12,9.53 90 top
R9  71.12,17.02 0 top
R10  52.2,15.11 270 top
R11  45.21,15.11 90 top
R12  17.4,8.76 180 top
R13  17.4,11.3 180 top
R14  17.4,13.84 180 top
R15  17.4,16.38 180 top
R16  17.4,18.92 180 top
R17  57.15,22.73 0 top
R18  41.91,20.19 270 top
R19  17.4,21.46 180 top
R20  17.4,24 180 top
R21  17.4,26.54 180 top
R22  95.25,50.67 180 top
R23  69.34,36.7 270 top
R24  62.99,36.7 270 top
R25  60.45,36.7 270 top
R26  16.26,38.1 0 top
R27  16.26,40.64 0 top
R28  95.25,55.75 180 top
R29  57.91,42.29 90 top
R30  55.88,42.29 90 top
R31  53.47,42.29 90 top
R32  51.82,42.29 90 top
R33  50.16,42.29 90 top
R34  48.51,42.29 90 top
R35  46.74,42.29 90 top
R36  45.09,42.29 90 top
R37  43.43,42.29 90 top
R38  41.78,42.29 90 top
R39  39.88,42.29 90 top
R40  38.1,42.29 90 top
R41  36.32,42.29 90 top
R42  34.54,42.29 90 top
R43  16.26,43.18 0 top
R44  16.26,45.72 0 top
R45  19.68,36.07 0 top
R46  19.68,33.53 0 top
R47  20.45,50.8 90 top
R48  4.95,45.72 180 top
R49  113.03,39.24 180 top
R50  113.03,36.7 180 top
R51  104.14,39.24 180 top
S1  58.42,15.11 0 top
S2  39.12,13.59 180 top
S3  68.58,21.46 0 top
S4  58.42,27.81 180 top
S5  48.26,21.46 0 top
SD1  73.66,40.51 180 top
U$1  [STAND-OFF-TIGHT]  29.46,4.95 180 top
U$2  [STAND-OFF-TIGHT]  100.33,3.68 180 top
U$3  [STAND-OFF-TIGHT]  78.74,45.59 180 top
X1  43.18,49.4 180 top
X2  107.95,49.4 180 top

### Tracks (layer width: path | path; a pad name or v marks a point on that pad's centre or on a via)
3V3_PWR6  (via drill 0.38)
  Top 0.254: SD1.4 67.96,36.55 67.31,35.9 | CFG1.6 70.23,30.33 71.32,31.43 71.32,33.92 R23.2 | S3.B' 72.39,23.87
  Top 0.406: R25.2 R24.2 67.31,35.9 R23.2
  Top 0.508: CFG1.2 CFG1.4 72.39,28.96 72.39,23.87 | S3.B' 70.17,25.27 v69.85,25.27 | S4.B' 54.01,25.81 S5.B' | C3.2 v88.9,39.24 90.17,37.97 90.17,32.89 84.33,27.05 80.01,27.05 79.32,26.37 79.32,23.76 75.51,19.95 75.51,17.41 71.12,13.02 R8.2 R7.2 R6.2 R5.2 R4.2 R3.2 R2.2 R1.2 | S2.B' S2.B 45.5,11.59 50.98,17.07 52.95,17.07 52.99,17.11 S1.B S1.B' 61.82,18.06 60.96,18.92 60.96,20.19 64.23,23.46 S3.B 64.17,23.46 S4.B S4.B' | S4.B' 54.61,26.22 54.61,26.54 55.88,27.81 63.5,27.81 65.02,29.34 CFG1.10 CFG1.8 CFG1.6
  Bottom 0.508: H1.3.3V 88.9,49.4 v88.9,39.24 88.9,37.97 B1.LV 76.45,29.34 CFG1.2 | v69.85,25.27 69.85,28.96 CFG1.6
5V0  (via drill 0.38)
  Top 0.406: B1.HV 96.52,39.24 100.33,39.24 | 100.33,39.24 R51.2 | 100.33,39.24 101.6,37.97 v102.87,37.97 | 107.35,37.8 110.49,37.8 | 110.73,37.8 R49.2 | 111.09,37.8 R50.2
  Top 0.508: H1.5V@0 89.53,46.23 89.95,46.23 | C1.1 91.65,37.76 | 91.65,37.76 91.86,37.97 B1.HV | v106.68,37.97 107.17,37.97 107.35,37.8 | 110.49,37.8 110.73,37.8 111.09,37.8 | 89.95,46.23 R22.2 92.71,52.36 92.71,54.48 93.98,55.75 R28.2 | 89.95,46.23 89.95,39.46 91.65,37.76
  Bottom 0.406: v102.87,37.97 v106.68,37.97
5V0_PS2
  Bottom 0.61: PWR_2.P4 19.05,39.24 17.78,40.51 17.78,48.13 15.24,50.67 PS2_B.4
AUDIO2-LEFT
  Top 0.254: H1.D45 21.12,36.7 R45.2
AUDIO2-RIGHT
  Top 0.254: H1.D43 21.12,34.16 R46.2
BLUE
  Top 0.254: X1.3 43.42,45.35 44.45,44.32 48.26,44.32 48.26,43.34 R34.2 R33.2 R32.2 R31.2
BLUE1
  Top 0.254: R31.1 53.47,38.1 41.91,26.54 34.29,26.54 26.67,18.92 26.67,15.11 H1.D26
BLUE2
  Top 0.254: R32.1 51.82,37.72 41.91,27.81 31.75,27.81 H1.D32
BLUE3
  Top 0.254: R33.1 50.16,37.34 41.91,29.08 30.48,29.08 H1.D34
BLUE4
  Top 0.254: R34.1 48.51,36.96 41.91,30.35 29.21,30.35 H1.D36
GND  (via drill 0.38)
  Top 0.254: 73.69,54.48 SD1.MT1 | SD1.MT2 72.36,54.95 SD1.MT1 | SD1.6 70.16,52.51 71.63,53.98 73.18,53.98 SD1.MT1
  Top 0.61: 73.69,54.48 H1.GND@1 H1.GND@0
  other vias: 46.99,15.11 49.53,13.84 53.34,21.46 88.9,34.16 91.44,34.16
  pour Bottom: 119.38,57.15 24.13,57.15 24.13,1.14 119.38,1.14
  pour Top: 24.13,57.02 24.13,1.14 119.38,1.14 119.38,57.02
GREEN
  Top 0.254: X1.2 41.14,43.74 R38.2 R37.2 R36.2 R35.2
GREEN1
  Top 0.254: R35.1 46.74,36.45 41.91,31.62 27.94,31.62 H1.D38
GREEN2
  Top 0.254: R36.1 45.09,36.07 41.91,32.89 26.67,32.89 H1.D40
GREEN3
  Top 0.254: H1.D42 40.64,34.16 43.43,36.96 R37.1
GREEN4
  Top 0.254: H1.D44 31.75,36.7 33.02,35.43 39.37,35.43 41.78,37.85 R38.1
HORIZONTAL_SYNC
  Top 0.254: R29.1 57.91,40.01 41.91,24 34.29,24 29.21,18.92 29.21,12.57 H1.D22
IEC-H-ATN
  Top 0.254: B1.HV1 99.73,43.05 99.78,43 102.22,43 102.32,43.1 103.42,43.1 103.47,43.05 106.68,43.05 X2.3 99.06,53.21 C2.2 R28.1
IEC-H-CLK
  Top 0.254: R49.1 114.3,39.66 114.3,40.51 X2.4 111.76,40.51 108.55,40.51 108.5,40.56 107.4,40.56 107.3,40.46 102.32,40.46 102.27,40.51 B1.HV2 93.98,40.51 91.93,42.56 C4.2
IEC-H-DATA  (via drill 0.38)
  Top 0.254: R50.1 114.3,36.7 | 114.3,36.7 115.57,36.7 116.84,37.97 116.84,43.05 X2.5 | v104.14,36.7 100.33,32.89 B1.HV3 93.58,31.23 C5.2 | v106.68,36.7 107.95,35.43 113.03,35.43 114.3,36.7
  Bottom 0.254: v104.14,36.7 v106.68,36.7
IEC-H-RESET
  Top 0.254: X2.6 R51.1 105.41,38.82 105.41,36.7 99.06,30.35 B1.HV4 C6.2
IEC-H-SRQ
  Top 0.254: R22.1 100.33,46.44 X2.1
IEC-L-ATN
  Bottom 0.254: 68.58,49.4 78.74,49.4 B1.LV1 | 35.56,16.38 H1.D28
  Bottom 0.305: 68.58,49.4 35.56,16.38
IEC-L-CLK
  Top 0.254: H1.D4 66.04,8.76 74.93,17.65 74.93,20.19 78.74,24 78.74,34.16 B1.LV2
IEC-L-DATA
  Bottom 0.254: H1.D5 68.58,16.38 B1.LV3
IEC-L-RESET  (via drill 0.38)
  Top 0.305: v74.93,50.67 80.01,50.67 87.63,43.05 87.63,32.89 B1.LV4
  Bottom 0.305: H1.D30 35.7,18.92 67.45,50.67 v74.93,50.67
JOY_3V3
  Top 0.254: R12.2 R13.2 R14.2 R15.2 R16.2 | R16.2 R19.2 R20.2 R21.2 | PWR_1.P3 19.14,21.46 19.03,21.35 19.03,20.89 18.78,20.63 18.31,20.63 R16.2
JOY_GND
  Top 0.254: LED1.C LED2.C LED3.C LED4.C 12.33,46.36 | 12.33,46.36 12.33,46.49 12.7,46.86 PWR_2.P1 21.08,46.86 22.86,48.64 H1.GND@4 | 19.81,26.54 PWR_1.P1 | 12.33,46.36 9.28,49.4 7.11,49.4 6.12,50.4 PS2_B.3
  Top 0.406: C9.2 C8.2 | PS2_B.3 5.08,50.67 1.65,47.24 AJ2.COM2 1.52,44.7 1.52,37.47 AJ2.COM1
  pour Bottom: 24.13,1.14 0,1.14 0,57.02 24.13,57.02
  pour Top: 0,57.02 24.13,57.02 24.13,1.14 0,1.14
JS1_1
  Top 0.254: H1.D13 R1.1
  Bottom 0.254: JS1.1 98.15,13.95 H1.D13
JS1_2
  Top 0.254: H1.D11 R3.1
  Bottom 0.254: JS1.2 98.6,16.69 90.42,8.51 87.63,8.51 H1.D11
JS1_3
  Top 0.254: H1.D9 R5.1
  Bottom 0.254: JS1.3 98.81,19.43 89.66,10.29 84.33,10.29 H1.D9
JS1_4
  Top 0.254: H1.D8 R6.1
  Bottom 0.254: JS1.4 100.53,22.17 89.41,11.05 82.55,11.05 H1.D8
JS1_5
  Top 0.254: H1.D6 R8.1
  Bottom 0.254: 73.15,8.26 H1.D6
  Bottom 0.305: JS1.5 101.24,24.92 88.9,12.57 77.47,12.57 73.15,8.26
JS1_6
  Top 0.254: H1.D12 R2.1
  Bottom 0.254: JS1.6 98.5,15.32 90.68,7.49 89.15,7.49 H1.D12
JS1_7
  Top 0.254: R4.1 H1.D10
  Bottom 0.254: JS1.7 98.7,18.06 89.92,9.27 85.85,9.27 H1.D10
JS1_9
  Top 0.254: H1.D7 R7.1
  Bottom 0.254: JS1.9 100.89,23.55 89.15,11.81 79.25,11.81 H1.D7
JS2_1
  Top 0.254: H1.D31 21.59,20.19 19.47,20.19 R16.1
  Bottom 0.254: JS2.1 12.7,25.27 17.78,20.19 21.59,20.19 H1.D31
JS2_2
  Top 0.254: H1.D29 R15.1
  Bottom 0.254: JS2.2 12.88,22.55 17.78,17.65 21.59,17.65 H1.D29
JS2_3
  Top 0.254: H1.D27 R14.1
  Bottom 0.254: JS2.3 13.08,19.81 17.78,15.11 21.59,15.11 H1.D27
JS2_4
  Top 0.254: H1.D25 R13.1
  Bottom 0.254: JS2.4 13.28,17.07 19.05,11.3 H1.D25
JS2_5
  Top 0.254: H1.D23 R12.1
  Bottom 0.254: JS2.5 13.49,14.33 19.05,8.76 H1.D23
JS2_6
  Top 0.254: H1.D33 21.59,22.73 19.47,22.73 R19.1
  Bottom 0.254: JS2.6 10.16,25.53 11.68,27.05 13.46,27.05 17.78,22.73 21.59,22.73 H1.D33
JS2_7
  Top 0.254: H1.D35 21.59,25.27 19.47,25.27 R20.1
  Bottom 0.254: JS2.7 9.17,21.18 7.62,22.73 7.62,26.54 8.89,27.81 15.24,27.81 17.78,25.27 21.59,25.27 H1.D35
JS2_9
  Top 0.254: H1.D37 21.59,27.81 19.47,27.81 | 19.47,27.81 R21.1 | JS2.9 9.58,15.7 6.35,18.92 6.35,26.54 7.62,27.81 19.47,27.81
LED1
  Top 0.254: R26.2 21.72,38.1 H1.D47
LED2
  Top 0.254: R27.2 21.72,40.64 H1.D49
LED3
  Top 0.254: R43.2 21.72,43.18 H1.D51
LED4
  Top 0.254: R44.2 21.72,45.72 H1.D53
N$1
  Top 0.254: R45.1 17.82,36.07 C8.1 17.18,36.03 16.51,36.7 12.19,36.7 10.79,38.1 10.79,38.48 9.91,39.37 8.13,39.37 7.49,40.01 7.49,44.32 AJ2.L
N$3
  Top 0.254: R44.1 LED4.A
N$4
  Top 0.254: X1.13 43.42,54.73 44.45,55.75 50.8,55.75 52.07,54.48 52.07,47.66 R29.2
N$5
  Top 0.254: X1.14 45.71,53.2 46.99,54.48 49.53,54.48 50.8,53.21 50.8,46.9 R30.2
N$9
  Top 0.254: R43.1 LED3.A
N$10
  Top 0.254: R27.1 LED2.A
N$11
  Top 0.254: R26.1 LED1.A
N$15
  Top 0.254: R46.1 17.82,33.53 C9.1 17.18,30.39 15.62,28.83 9.14,28.83 4.57,33.4 AJ2.R
N$16
  Top 0.254: R47.2 14.19,51.6 13.46,52.32 9.87,52.32 PS2_B.1
N$17
  Top 0.254: R48.2 4.15,46.21 PS2_B.5
PS2CLK2  (via drill 0.38)
  Top 0.254: R48.1 5.75,43.73 v5.08,43.05
  Bottom 0.254: v5.08,43.05 5.08,40.51 8.89,36.7 15.24,36.7 H1.D39
PS2DAT2  (via drill 0.38)
  Top 0.254: v21.21,48.51 21.21,49.24 R47.1
  Bottom 0.254: H1.D41 21.59,32.89 21.59,48.13 v21.21,48.51
RED
  Top 0.254: X1.1 38.85,43.84 R40.2 | R39.2 R40.2 | R40.2 R41.2 R42.2
RED1
  Top 0.254: H1.D52 27.94,46.86 33.31,41.49 R42.1
RED2
  Top 0.254: H1.D50 29.21,44.32 34.29,39.24 35.56,39.24 36.32,40.01 R41.1
RED3
  Top 0.254: H1.D48 30.48,41.78 34.29,37.97 36.83,37.97 38.1,39.24 R40.1
RED4
  Top 0.254: H1.D46 31.75,39.24 34.29,36.7 38.1,36.7 39.88,38.48 R39.1
RESET  (via drill 0.38)
  Top 0.254: H1.D19 33.02,11.3 33.02,13.84 34.29,15.11 35.24,15.11 S2.A' S2.A 42.84,15.91 R11.2 46.06,16.76 v49.4,16.76
  Bottom 0.254: CFG1.9 54.86,31.88 49.53,26.54 49.53,16.89 v49.4,16.76
SD_!CS  (via drill 0.38)
  Top 0.254: v58.42,37.72 60.44,37.72 R25.1
  Top 0.406: SD1.2 65.76,47.09 60.45,41.78 R25.1
  Bottom 0.254: H1.D16 45.72,7.49 38.1,15.11 38.1,17.4 42.04,21.34 v58.42,37.72
SD_CD  (via drill 0.38)
  Top 0.254: v71.63,38.23 71.63,40.92 SD1.CD1
  Bottom 0.254: H1.D3 63.5,13.08 74.17,23.75 74.17,35.43 71.88,37.72 71.88,37.97 v71.63,38.23
SD_MISO  (via drill 0.38)
  Top 0.254: R23.1 69.36,37.72 70.48,37.72 v71.5,36.7
  Top 0.406: SD1.7 71.26,44.97 69.34,43.05 R23.1
  Bottom 0.254: H1.D2 60.96,12.83 71.5,23.37 v71.5,36.7
SD_MOSI  (via drill 0.38)
  Top 0.254: v65.02,37.47 63.23,37.47 R24.1
  Top 0.406: SD1.3 66.86,46.92 62.99,43.05 R24.1
  Bottom 0.254: H1.D14 66.42,21.84 66.42,36.45 65.41,37.47 v65.02,37.47
SD_SCK  (via drill 0.38)
  Top 0.254: SD1.5 69.06,45.82 v68.83,45.59
  Bottom 0.254: H1.D15 39.37,15.11 39.37,17.4 67.56,45.59 v68.83,45.59
SW_DOWN  (via drill 0.38)
  Top 0.254: H1.D20 35.56,7.49 31.75,11.3 31.75,15.11 34.29,17.65 52.7,17.65 55.75,20.7 57.28,20.7 57.95,21.37 R17.2 57.95,23.2 57.15,24 v54.61,24 | CFG1.5 68.78,30.43 64.7,30.43 64.08,29.81 S4.A S4.A' 53.34,28.13 v53.34,27.81
  Bottom 0.254: v54.61,24 54.61,26.54 v53.34,27.81
SW_LEFT
  Top 0.254: S3.A' S3.A 66.04,18.6 66.04,13.84 63.5,11.3 58.42,11.3 55.88,8.76 44.45,8.76 43.18,7.49 H1.D17 | S3.A' 71.98,17.08 R9.2 | CFG1.1 77.22,29.97 77.22,24.7 S3.A'
SW_RIGHT
  Top 0.254: S5.A' 50.8,19.46 | 50.8,19.46 S5.A 41.98,19.46 R18.2 41.15,18.63 34,18.63 30.73,15.37 30.73,11.05 33.02,8.76 H1.D21 | CFG1.7 67.69,33.78 67.18,34.29 54.74,34.29 48.26,27.81 48.26,22 50.8,19.46
SW_UP
  Top 0.254: H1.D18 40.64,8.76 41.91,10.03 50.8,10.03 52.07,11.3 52.07,14.19 R10.2 53.82,14.31 S1.A S1.A' 64.77,16.06 64.77,17.65 63.89,18.53 63.44,18.53 63.05,18.92 62.23,18.92 62.23,20.19 63.5,21.46 67.31,21.46 68.58,22.73 68.58,25.27 71.5,28.19 71.5,30.73 71.63,30.86 71.63,30.99 72.52,31.88 CFG1.3
VERTICAL_SYNC
  Top 0.254: R30.1 55.88,39.24 41.91,25.27 34.29,25.27 27.94,18.92 27.94,13.84 H1.D24

### Text on the board
Dimension: V-Score | V-Score
tPlace: AUDIO 2 | PS/2 B | SD Card | VGA | Papilio Platform | C64 Shield V0.42 | UP | (c) deFEEST WTF | www.defeest.nl BIBS001 | LEFT | RIGHT | PS/2 A | DOWN | RESET | JOYSTICK 1 | Joystick 2 | Get Started at CompShield.GadgetFactory.Net | /home/paul/work/fpga/papilio/computing-shield/c64-wing/255px-CBM_Logo.svg.bmp | /home/paul/work/fpga/papilio/computing-shield/c64-wing/255px-CBM_Logo.svg.bmp | /home/paul/work/fpga/papilio/computing-shield/c64-wing/255px-CBM_Logo.svg.bmp
tNames: 6/17/2014
200bmp: /home/paul/work/fpga/papilio/computing-shield/c64-wing/255px-CBM_Logo.svg.bmp
202bmp: /home/paul/work/fpga/papilio/computing-shield/c64-wing/255px-CBM_Logo.svg.bmp